# EasyEDA Pro project FrameworkGPU to MXM.epro, board PCB3
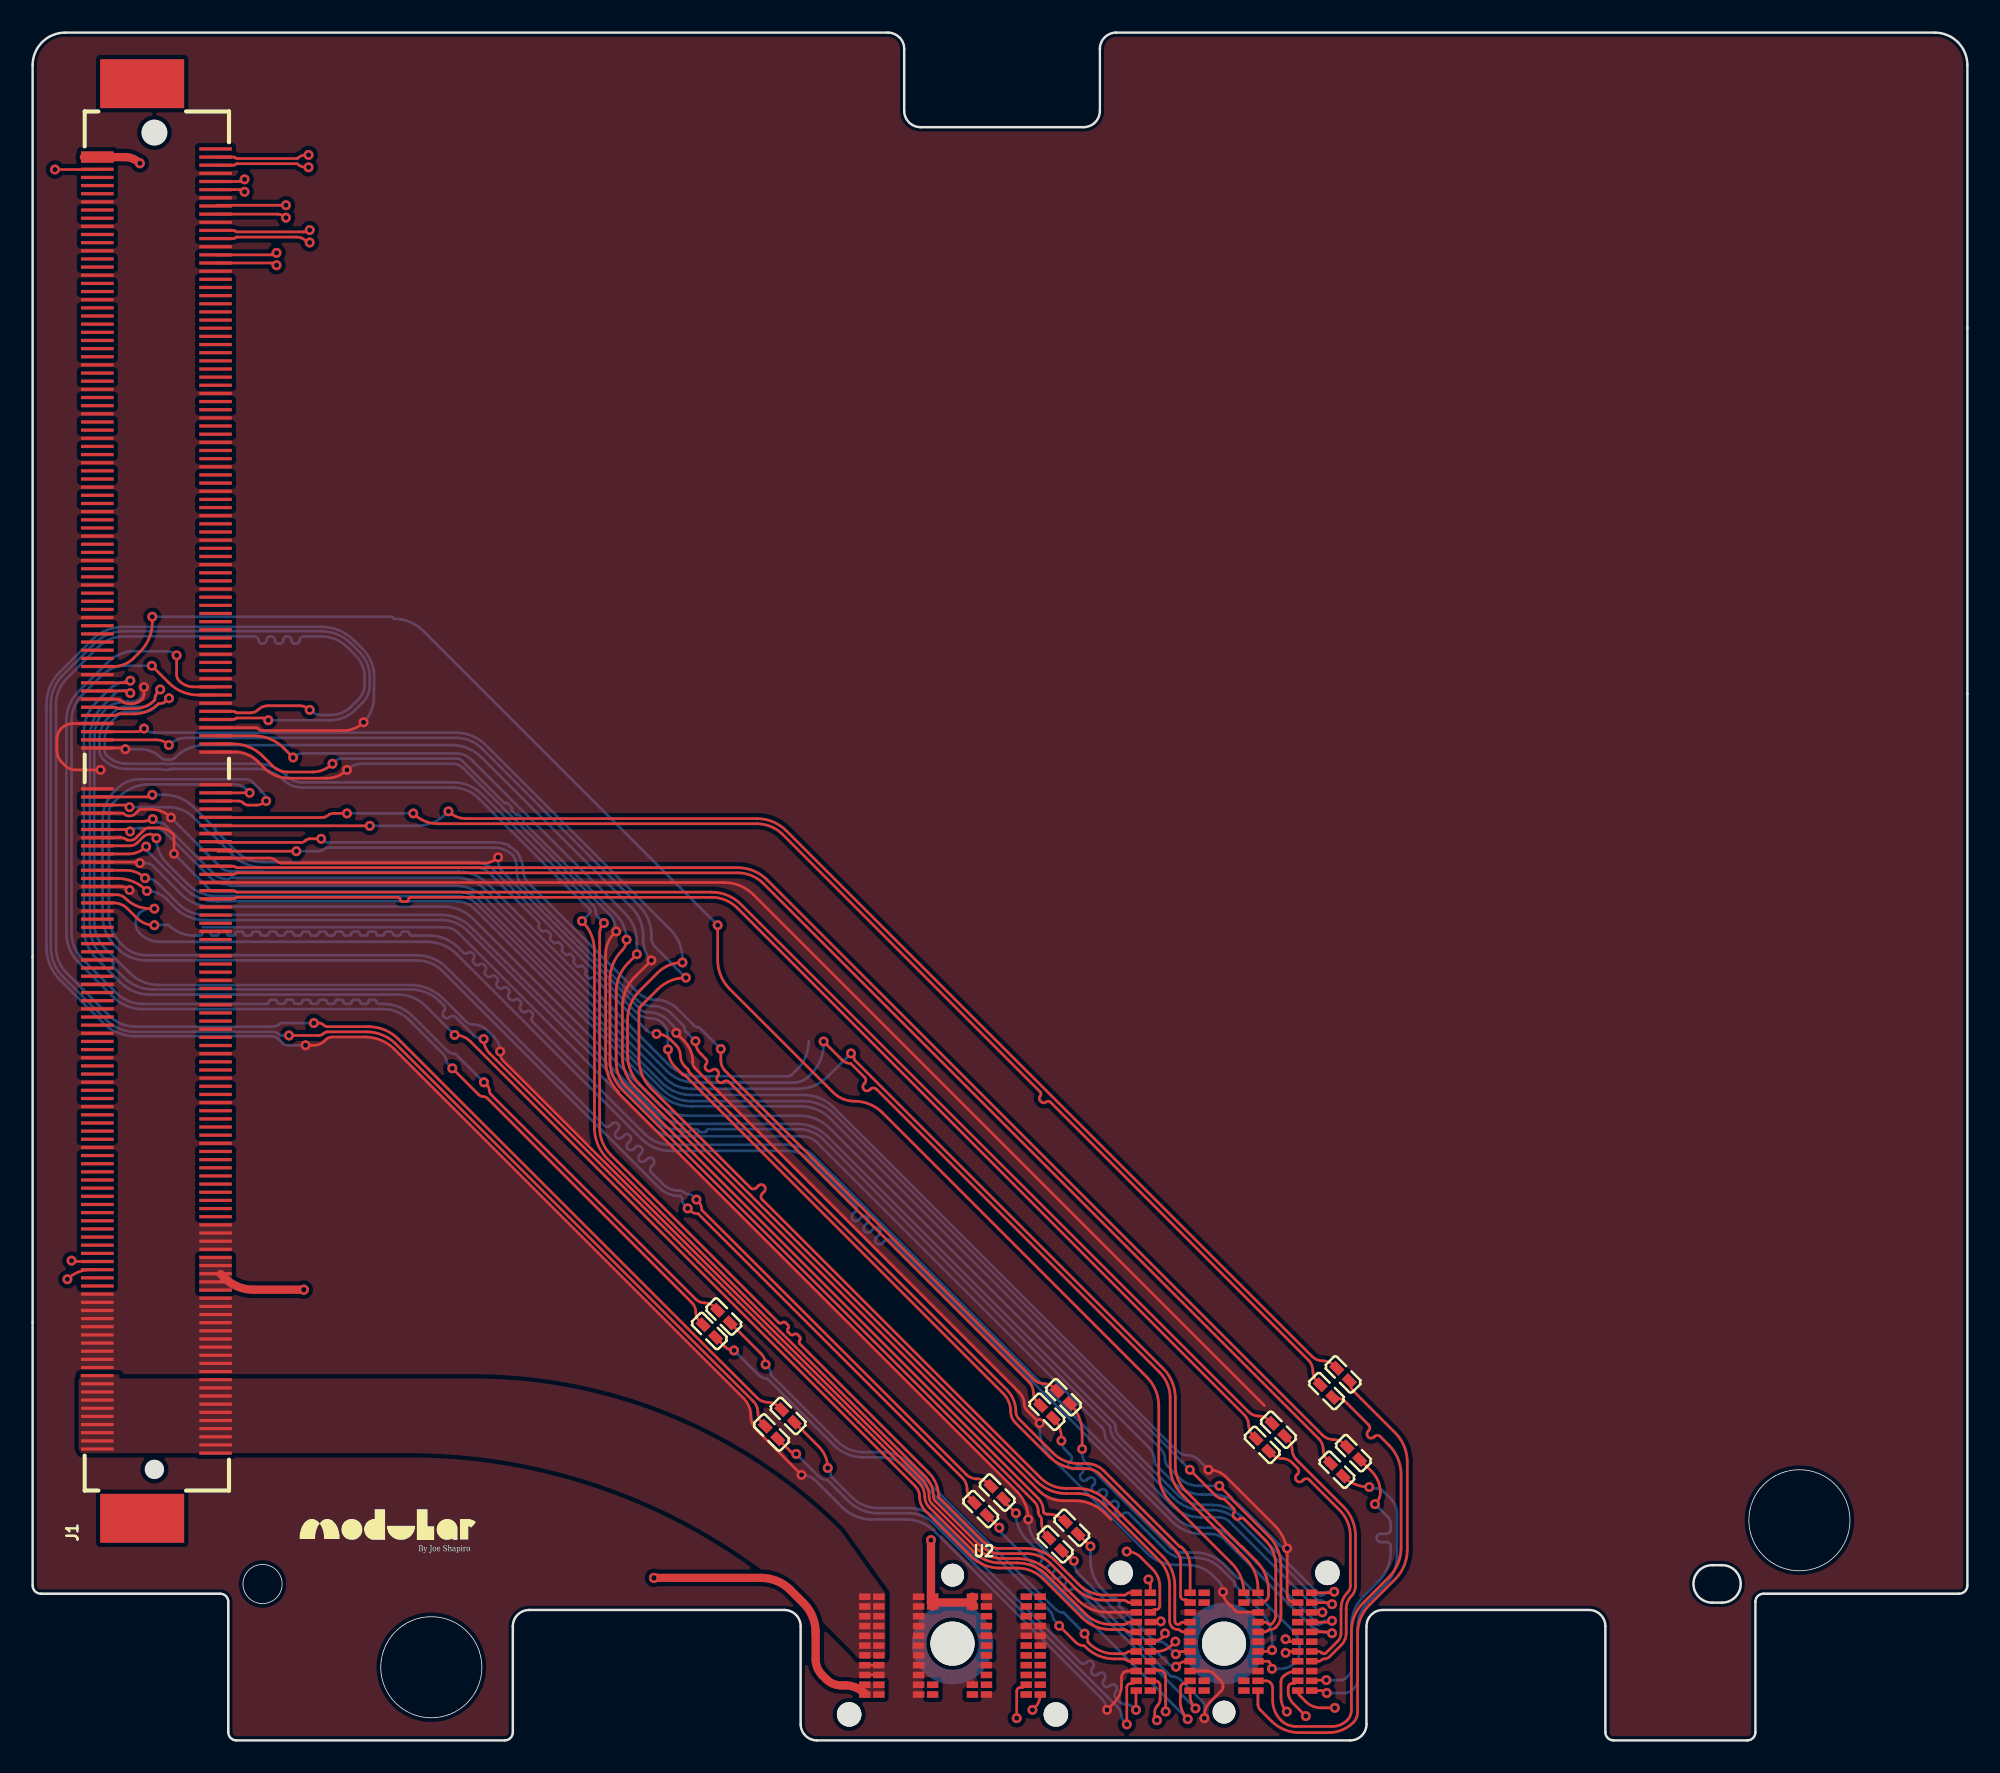
[diagram p1: board, top side]
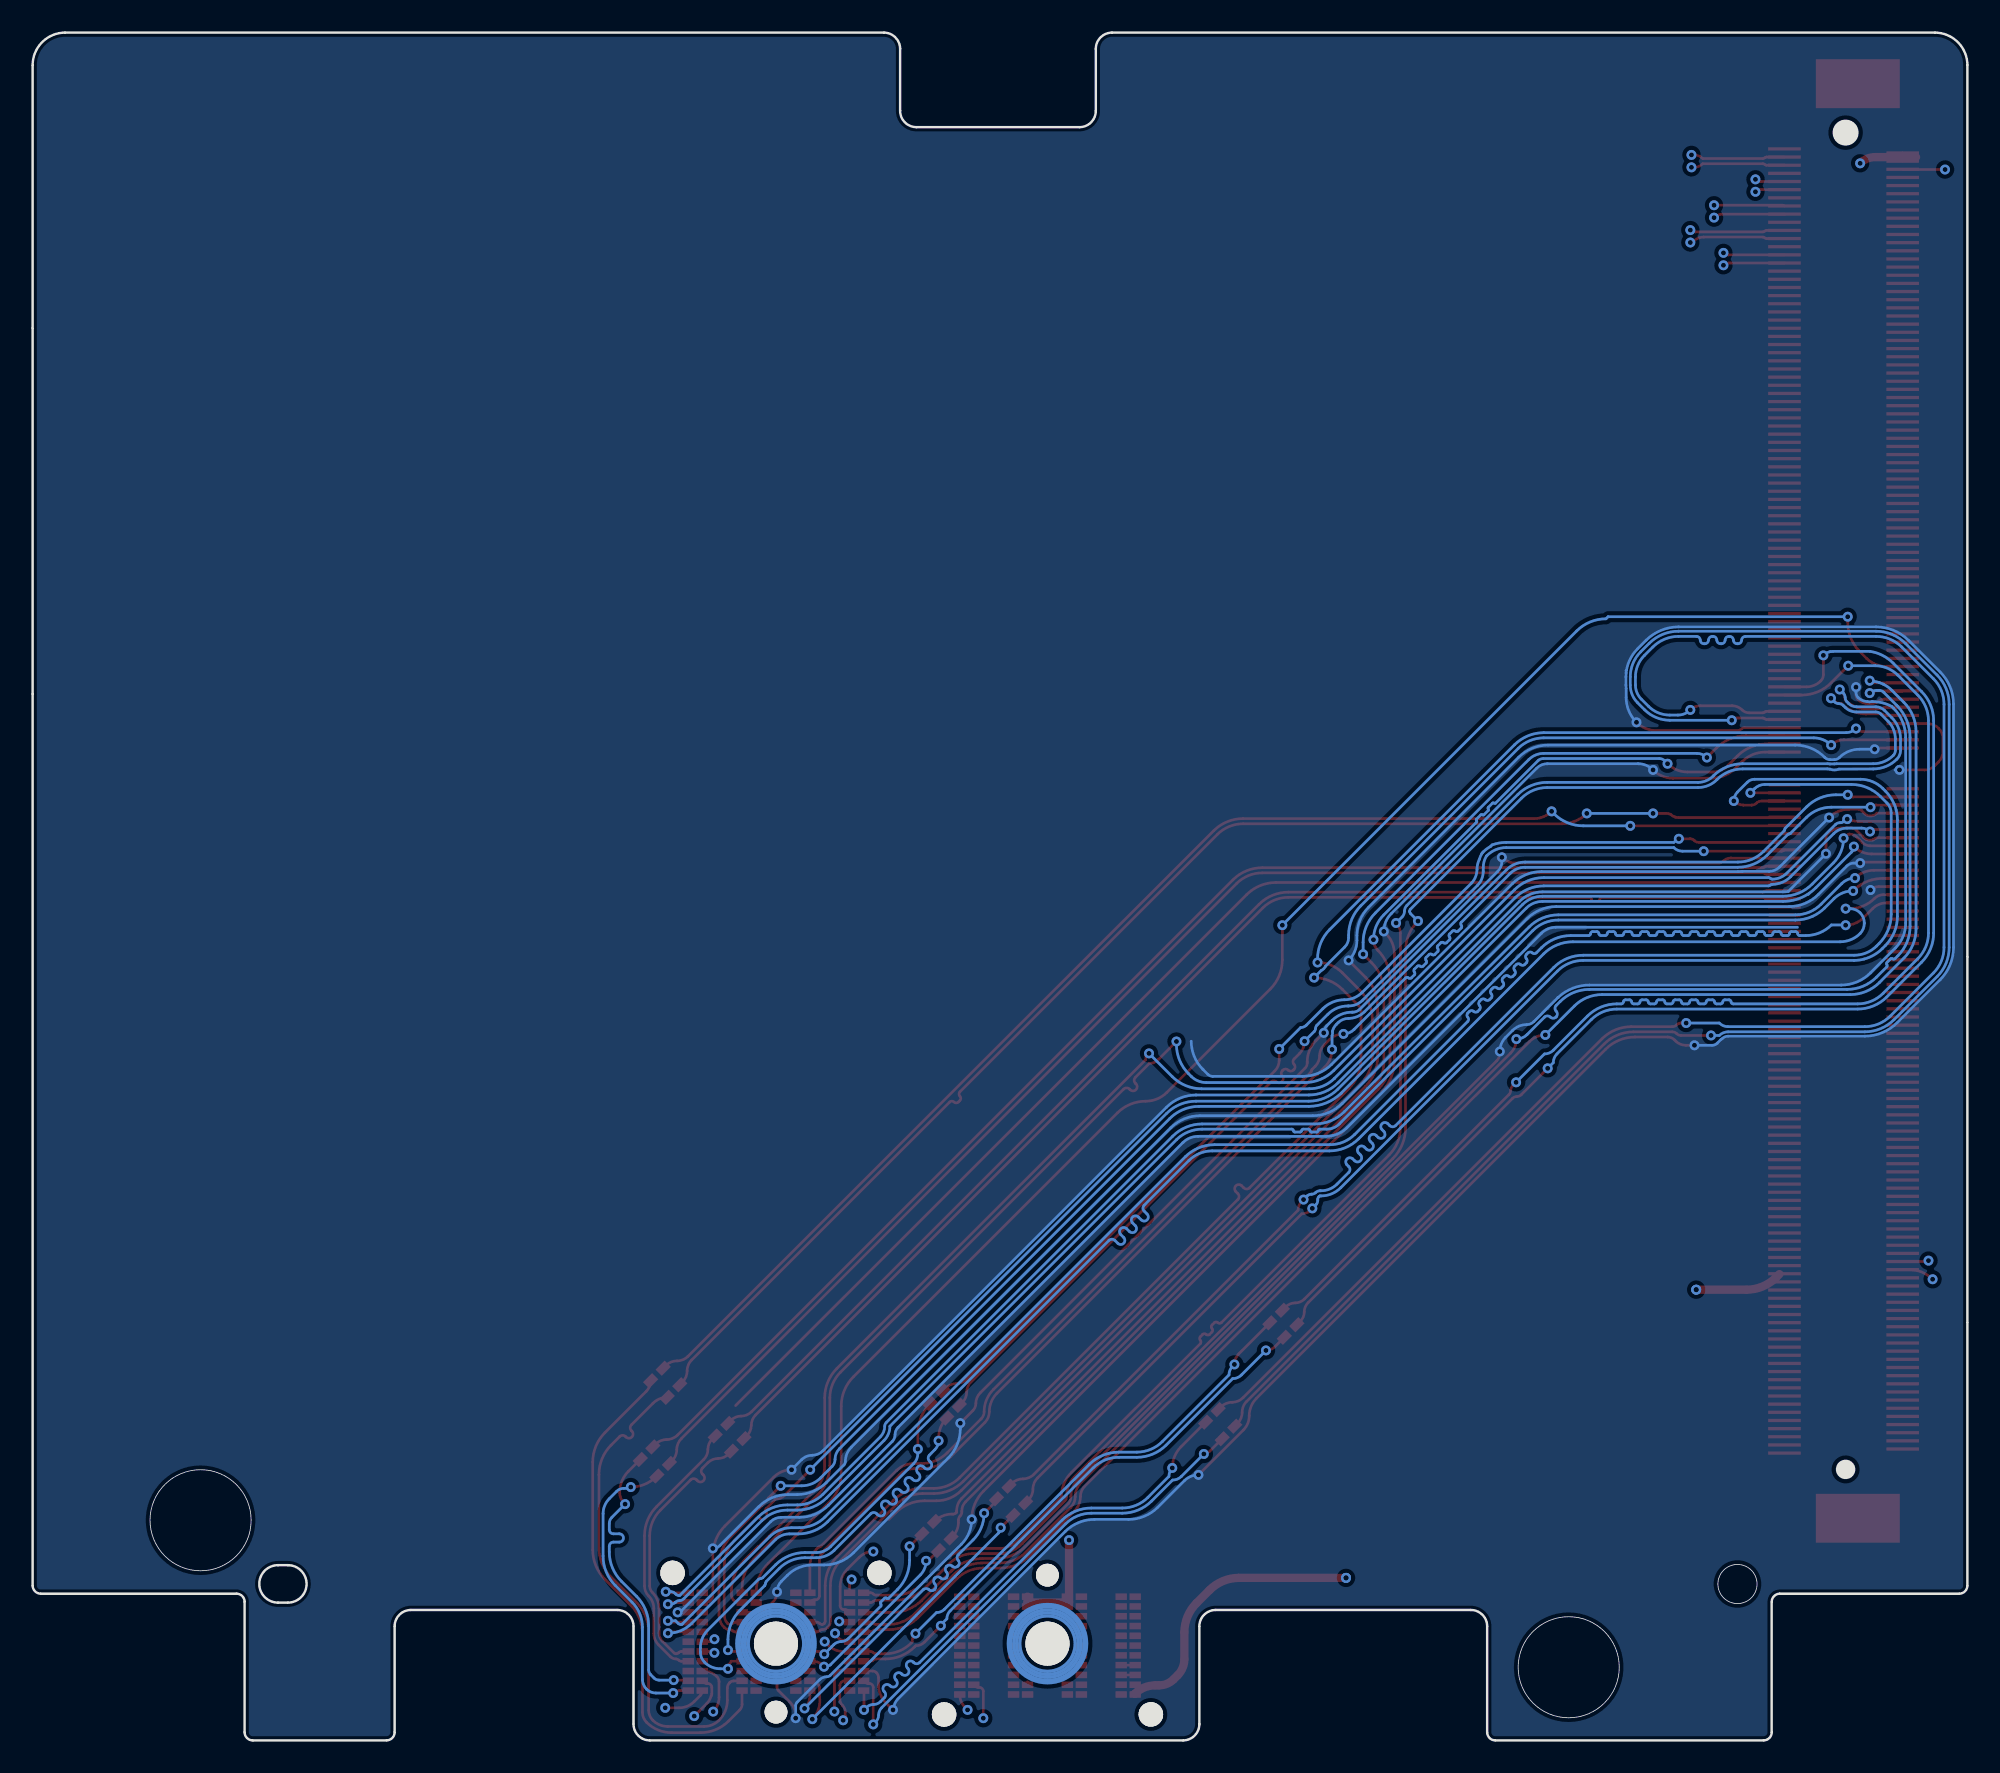
[diagram p2: board, bottom side, seen from below]

Outline 118.65 x 104.76 mm; copper layers: Top Layer, Inner1, Inner2, Inner3, Inner4, Inner5, Inner6, Bottom Layer. Coordinates in mm from the lower left corner of the outline.
Outline path: circle c14.1,9.59 r1.2 ; circle c24.45,4.49 r3.1 ; circle c108.35,13.5 r3.1 ; 0,102.76 arc(0.59,104.17) 2,104.76 52.45,104.76 arc(53.16,104.47) 53.45,103.76 53.45,99.96 arc(53.74,99.25) 54.45,98.96 64.45,98.96 arc(65.16,99.25) 65.45,99.96 65.45,103.76 arc(65.74,104.47) 66.45,104.76 116.65,104.76 arc(118.06,104.17) 118.65,102.76 118.65,9.5 arc(118.5,9.15) 118.15,9 106.15,9 arc(105.8,8.85) 105.65,8.5 105.65,0.5 arc(105.5,0.15) 105.15,0 96.95,0 arc(96.6,0.15) 96.45,0.5 96.45,7 arc(96.16,7.71) 95.45,8 82.8,8 arc(82.09,7.71) 81.8,7 81.8,1 arc(81.51,0.29) 80.8,0 48.1,0 arc(47.39,0.29) 47.1,1 47.1,7 arc(46.81,7.71) 46.1,8 30.45,8 arc(29.74,7.71) 29.45,7 29.45,0.5 arc(29.3,0.15) 28.95,0 12.5,0 arc(12.15,0.15) 12,0.5 12,8.5 arc(11.85,8.85) 11.5,9 0.5,9 arc(0.15,9.15) 0,9.5 0,102.76 ; 103,8.45 arc(101.85,9.6) 103,10.75 103.6,10.75 arc(104.75,9.6) 103.6,8.45 103,8.45
Stack: Top Layer 0.035mm Outer layer thickness 1oz / Dielectric1 0.1164mm 2116 RC54% 4.9mil / Inner1 0.0152mm Inner layer thickness / Dielectric2 0.3mm 0.3mm H/HOZ No copper / Inner2 0.0152mm Inner layer thickness / Dielectric3 0.0764mm 1080 RC67% 3.3mil / Dielectric4 0.0764mm 1080 RC67% 3.3mil / Inner3 0.0152mm Inner layer thickness / Dielectric5 0.3mm 0.3mm H/HOZ No copper / Inner4 0.0152mm Inner layer thickness / Dielectric6 0.0764mm 1080 RC67% 3.3mil / Dielectric7 0.0764mm 1080 RC67% 3.3mil / Inner5 0.0152mm Inner layer thickness / Dielectric8 0.3mm 0.3mm H/HOZ No copper / Inner6 0.0152mm Inner layer thickness / Dielectric9 0.1164mm 2116 RC54% 4.9mil / Bottom Layer 0.035mm Outer layer thickness 1oz

## Design rules (mm)
net PCIE_TX_0P: PCIE_TX_0
net $1N3808: DP9
net PCIE_TX_0N: PCIE_TX_0
net $1N3802: DP9
net PCIE_TX_1P: PCIE_TX_1
net $1N3862: DP8
net PCIE_TX_1N: PCIE_TX_1
net $1N3868: DP8
net PCIE_TX_2P: PCIE_TX_2
net $1N3922: DP7
net PCIE_TX_2N: PCIE_TX_2
net $1N3928: DP7
net PCIE_TX_3P: PCIE_TX_3
net $1N3982: DP6
net PCIE_TX_3N: PCIE_TX_3
net $1N3988: DP6
net PCIE_TX_4P: PCIE_TX_4
net $1N4042: DP5
net PCIE_TX_4N: PCIE_TX_4
net $1N4048: DP5
net PCIE_TX_5P: PCIE_TX_5
net $1N4102: DP2
net PCIE_TX_5N: PCIE_TX_5
net $1N4108: DP2
net PCIE_TX_6P: PCIE_TX_6
net $1N4162: DP3
net PCIE_TX_6N: PCIE_TX_6
net $1N4168: DP3
net PCIE_TX_7P: PCIE_TX_7
net $1N4222: DP4
net PCIE_TX_7N: PCIE_TX_7
net $1N4228: DP4
net DP_A_AUXP: DP_A_AUX
net DP_A_AUXN: DP_A_AUX
net DP_A_L3P: DP_A_L3
net DP_A_L3N: DP_A_L3
net DP_A_L2P: DP_A_L2
net DP_A_L2N: DP_A_L2
net DP_A_L1P: DP_A_L1
net DP_A_L1N: DP_A_L1
net DP_A_L0P: DP_A_L0
net DP_A_L0N: DP_A_L0
net PCIE_RX_0P: PCIE_RX_0
net PCIE_RX_0N: PCIE_RX_0
net PCIE_RX_1P: PCIE_RX_1
net PCIE_RX_1N: PCIE_RX_1
net PCIE_RX_2P: PCIE_RX_2
net PCIE_RX_2N: PCIE_RX_2
net PCIE_RX_3P: PCIE_RX_3
net PCIE_RX_3N: PCIE_RX_3
net PCIE_RX_4P: PCIE_RX_4
net PCIE_RX_4N: PCIE_RX_4
net PCIE_RX_5P: PCIE_RX_5
net PCIE_RX_5N: PCIE_RX_5
net PCIE_RX_6P: DP1
net PCIE_RX_6N: DP1
net PCIE_RX_7P: PCIE_RX_7
net PCIE_RX_7N: PCIE_RX_7
template: Custom Config
spacing copperThickness1oz (default): track to track 0.102, other pairs 0.152 to 0.3
spacing copperThickness2oz: track to track 0.203, other pairs 0.152 to 0.3
track width copperThickness1oz (default): min 0.127, default 0.254, max 2.54
track width copperThickness2oz: min 0.203, default 0.254, max 2.54
differential pair differentialPair (default): width min 0.127, default 0.254, max 2.54; gap min 0.152, default 0.152
via viaSize (default): diameter min 0.5, default 0.61, max 10; hole min 0.3, default 0.305, max 6.3
pour e983 uses copperRegion
pour e1099 uses copperRegion

## Placement (name value [footprint] x y rotation side)
C1  220nF  [C0402]  41.5 25.11 315 top
C2  220nF  [C0402]  42.39 26 315 top
C3  220nF  [C0402]  46.33 19.91 315 top
C4  220nF  [C0402]  45.31 18.89 315 top
C5  220nF  [C0402]  63.73 13.05 315 top
C6  220nF  [C0402]  62.71 12.03 315 top
C7  220nF  [C0402]  59.16 15.21 315 top
C8  220nF  [C0402]  58.14 14.19 315 top
C9  220nF  [C0402]  79.35 21.43 315 top
C10  220nF  [C0402]  80.36 22.45 315 top
C11  220nF  [C0402]  63.22 21.05 315 top
C12  220nF  [C0402]  62.2 20.16 315 top
C13  220nF  [C0402]  81 17.62 315 top
C14  220nF  [C0402]  79.98 16.6 315 top
C15  220nF  [C0402]  76.4 19.06 315 top
C16  220nF  [C0402]  75.41 18.13 315 top
J1  MXM3.0  [CONN-SMD_314P-P0.50_10151114-001TLF]  7.59 57.62 90 top
U2  FXBeam  [FW_FXBEAM_FULL]  64.74 5.94 0 top

## Footprints (pads in the part's own frame, mm; a bottom-side part is the same pattern mirrored in y, then rotated)
C0402
  rect 0.79x0.54 smd: 1(-0.545,0) 2(0.545,0)
CONN-SMD_314P-P0.50_10151114-001TLF
  rect 0.2x2 smd: 1(-30,-3.625) 2(-29.75,3.625) 3(-29.5,-3.625) 4(-29.25,3.625) 5(-29,-3.625) 6(-28.75,3.625) 7(-28.5,-3.625) 8(-28.25,3.625) 9(-28,-3.625) 10(-27.75,3.625) 11(-27.5,-3.625) 12(-27.25,3.625) 13(-27,-3.625) 14(-26.75,3.625) 15(-26.5,-3.625) 16(-26.25,3.625) 17(-26,-3.625) 18(-25.75,3.625) 19(-25.5,-3.625) 20(-25.25,3.625) 21(-25,-3.625) 22(-24.75,3.625) 23(-24.5,-3.625) 24(-24.25,3.625) 25(-24,-3.625) 26(-23.75,3.625) 27(-23.5,-3.625) 28(-23.25,3.625) 29(-23,-3.625) 30(-22.75,3.625) 31(-22.5,-3.625) 32(-22.25,3.625) 33(-22,-3.625) 34(-21.75,3.625) 35(-21.5,-3.625) 36(-21.25,3.625) 37(-21,-3.625) 38(-20.75,3.625) 39(-20.5,-3.625) 40(-20.25,3.625) 41(-20,-3.625) 42(-19.75,3.625) 43(-19.5,-3.625) 44(-19.25,3.625) 45(-19,-3.625) 46(-18.75,3.625) 47(-18.5,-3.625) 48(-18.25,3.625) 49(-18,-3.625) 50(-17.75,3.625) 51(-17.5,-3.625) 52(-17.25,3.625) 53(-17,-3.625) 54(-16.75,3.625) 55(-16.5,-3.625) 56(-16.25,3.625) 57(-16,-3.625) 58(-15.75,3.625) 59(-15.5,-3.625) 60(-15.25,3.625) 61(-15,-3.625) 62(-14.75,3.625) 63(-14.5,-3.625) 64(-14.25,3.625) 65(-14,-3.625) 66(-13.75,3.625) 67(-13.5,-3.625) 68(-13.25,3.625) 69(-13,-3.625) 70(-12.75,3.625) 71(-12.5,-3.625) 72(-12.25,3.625) 73(-12,-3.625) 74(-11.75,3.625) 75(-11.5,-3.625) 76(-11.25,3.625) 77(-11,-3.625) 78(-10.75,3.625) 79(-10.5,-3.625) 80(-10.25,3.625) 81(-10,-3.625) 82(-9.75,3.625) 83(-9.5,-3.625) 84(-9.25,3.625) 85(-9,-3.625) 86(-8.75,3.625) 87(-8.5,-3.625) 88(-8.25,3.625) 89(-8,-3.625) 90(-7.75,3.625) 91(-7.5,-3.625) 92(-7.25,3.625) 93(-7,-3.625) 94(-6.75,3.625) 95(-6.5,-3.625) 96(-6.25,3.625) 97(-6,-3.625) 98(-5.75,3.625) 99(-5.5,-3.625) 100(-5.25,3.625) 101(-5,-3.625) 102(-4.75,3.625) 103(-4.5,-3.625) 104(-4.25,3.625) 105(-4,-3.625) 106(-3.75,3.625) 107(-3.5,-3.625) 108(-3.25,3.625) 109(-3,-3.625) 110(-2.75,3.625) 111(-2.5,-3.625) 112(-2.25,3.625) 113(-2,-3.625) 114(-1.75,3.625) 115(-1.5,-3.625) 116(-1.25,3.625) 117(-1,-3.625) 118(-0.75,3.625) 119(-0.5,-3.625) 120(-0.25,3.625) 121(-0.001,-3.625) 122(0.25,3.625) 123(0.5,-3.625) 124(0.75,3.625) 125(1,-3.625) 133(3,-3.625) 134(3.249,3.625) 135(3.5,-3.625) 136(3.75,3.625) 137(4,-3.625) 138(4.25,3.625) 139(4.5,-3.625) 140(4.75,3.625) 141(5,-3.625) 142(5.25,3.625) 143(5.5,-3.625) 144(5.75,3.625) 145(6,-3.625) 146(6.25,3.625) 147(6.5,-3.625) 148(6.75,3.625) 149(7,-3.625) 150(7.25,3.625) 151(7.5,-3.625) 152(7.75,3.625) 153(8,-3.625) 154(8.25,3.625) 155(8.5,-3.625) 156(8.75,3.625) 157(9,-3.625) 158(9.25,3.625) 159(9.5,-3.625) 160(9.75,3.625) 161(10,-3.625) 162(10.25,3.625) 163(10.5,-3.625) 164(10.75,3.625) 165(11,-3.625) 166(11.25,3.625) 167(11.5,-3.625) 168(11.75,3.625) 169(12,-3.625) 170(12.25,3.625) 171(12.5,-3.625) 172(12.75,3.625) 173(13,-3.625) 174(13.25,3.625) 175(13.5,-3.625) 176(13.75,3.625) 177(14,-3.625) 178(14.25,3.625) 179(14.5,-3.625) 180(14.75,3.625) 181(15,-3.625) 182(15.25,3.625) 183(15.5,-3.625) 184(15.75,3.625) 185(16,-3.625) 186(16.25,3.625) 187(16.5,-3.625) 188(16.75,3.625) 189(17,-3.625) 190(17.25,3.625) 191(17.5,-3.625) 192(17.75,3.625) 193(18,-3.625) 194(18.25,3.625) 195(18.5,-3.625) 196(18.75,3.625) 197(19,-3.625) 198(19.25,3.625) 199(19.5,-3.625) 200(19.75,3.625) 201(20,-3.625) 202(20.25,3.625) 203(20.5,-3.625) 204(20.75,3.625) 205(21,-3.625) 206(21.25,3.625) 207(21.5,-3.625) 208(21.75,3.625) 209(22,-3.625) 210(22.25,3.625) 211(22.5,-3.625) 212(22.75,3.625) 213(23,-3.625) 214(23.25,3.625) 215(23.5,-3.625) 216(23.75,3.625) 217(24,-3.625) 218(24.25,3.625) 219(24.5,-3.625) 220(24.75,3.625) 221(25,-3.625) 222(25.25,3.625) 223(25.5,-3.625) 224(25.75,3.625) 225(26,-3.625) 226(26.25,3.625) 227(26.5,-3.625) 228(26.75,3.625) 229(27,-3.625) 230(27.25,3.625) 231(27.5,-3.625) 232(27.75,3.625) 233(28,-3.625) 234(28.25,3.625) 235(28.5,-3.625) 236(28.75,3.625) 237(29,-3.625) 238(29.25,3.625) 239(29.5,-3.625) 240(29.75,3.625) 241(30,-3.625) 242(30.25,3.625) 243(30.5,-3.625) 244(30.75,3.625) 245(31,-3.625) 246(31.25,3.625) 247(31.5,-3.625) 248(31.75,3.625) 249(32,-3.625) 250(32.25,3.625) 251(32.5,-3.625) 252(32.75,3.625) 253(33,-3.625) 254(33.25,3.625) 255(33.5,-3.625) 256(33.75,3.625) 257(34,-3.625) 258(34.25,3.625) 259(34.5,-3.625) 260(34.75,3.625) 261(35,-3.625) 262(35.25,3.625) 263(35.5,-3.625) 264(35.75,3.625) 265(36,-3.625) 266(36.25,3.625) 267(36.5,-3.625) 268(36.75,3.625) 269(37,-3.625) 270(37.25,3.625) 271(37.5,-3.625) 272(37.75,3.625) 273(38,-3.625) 274(38.25,3.625) 275(38.5,-3.625) 276(38.75,3.625) 277(39,-3.625) 278(39.25,3.625) 279(39.5,-3.625) 280(39.75,3.625) 281(40,-3.625) E1(-40,-3.625) E1(-39.5,-3.625) E1(-39,-3.625) E1(-38.5,-3.625) E1(-38,-3.625) E1(-37.5,-3.625) E1(-37,-3.625) E1(-36.5,-3.625) E1(-36,-3.625) E1(-35.5,-3.625) E2(-39.75,3.625) E2(-39.25,3.625) E2(-38.75,3.625) E2(-38.25,3.625) E2(-37.75,3.625) E2(-37.25,3.625) E2(-36.75,3.625) E2(-36.25,3.625) E2(-35.75,3.625) E2(-35.25,3.625) E3(-35,-3.625) E3(-34.5,-3.625) E3(-34,-3.625) E3(-33.5,-3.625) E3(-33,-3.625) E3(-32.5,-3.625) E3(-32,-3.625) E3(-31.5,-3.625) E3(-31,-3.625) E3(-30.5,-3.625) E4(-34.75,3.625) E4(-34.25,3.625) E4(-33.75,3.625) E4(-33.25,3.625) E4(-32.75,3.625) E4(-32.25,3.625) E4(-31.75,3.625) E4(-31.25,3.625) E4(-30.75,3.625) E4(-30.25,3.625)
  rect 3x5.15 smd: 282(44,0.875) 283(-44,0.875)
FW_FXBEAM_FULL
  round 1.5 hole 1.5: (-14.67,-4.34) (-1.99,-4.345) (1.98,4.34) (14.66,4.34)
  round 2.7 hole 2.7: (-8.33,0) (8.32,0)
  round 1.4 hole 1.4: (-8.325,4.2) (8.32,-4.2)
  rect 0.7x0.4 smd: PA1(-2.95,2.88) PA2(-3.81,2.88) PA3(-6.25,2.88) PA4(-7.11,2.88) PA5(-9.55,2.88) PA6(-10.41,2.88) PA7(-12.85,2.88) PA8(-13.71,2.88) PB1(-2.95,2.28) PB2(-3.81,2.28) PB3(-6.25,2.28) PB4(-7.11,2.28) PB5(-9.55,2.28) PB6(-10.41,2.28) PB7(-12.85,2.28) PB8(-13.71,2.28) PC1(-2.95,1.68) PC2(-3.81,1.68) PC3(-6.25,1.68) PC6(-10.41,1.68) PC7(-12.85,1.68) PC8(-13.71,1.68) PD1(-2.95,1.08) PD2(-3.81,1.08) PD3(-6.25,1.08) PD6(-10.41,1.08) PD7(-12.85,1.08) PD8(-13.71,1.08) PE1(-2.95,0.48) PE2(-3.81,0.48) PE3(-6.25,0.48) PE6(-10.41,0.48) PE7(-12.85,0.48) PE8(-13.71,0.48) PF1(-2.95,-0.12) PF2(-3.81,-0.12) PF3(-6.25,-0.12) PF6(-10.41,-0.12) PF7(-12.85,-0.12) PF8(-13.71,-0.12) PG1(-2.95,-0.72) PG2(-3.81,-0.72) PG3(-6.25,-0.72) PG6(-10.41,-0.72) PG7(-12.85,-0.72) PG8(-13.71,-0.72) PH1(-2.95,-1.32) PH2(-3.81,-1.32) PH3(-6.25,-1.32) PH6(-10.41,-1.32) PH7(-12.85,-1.32) PH8(-13.71,-1.32) PJ1(-2.95,-1.92) PJ2(-3.81,-1.92) PJ3(-6.25,-1.92) PJ6(-10.41,-1.92) PJ7(-12.85,-1.92) PJ8(-13.71,-1.92) PK1(-2.95,-2.52) PK2(-3.81,-2.52) PK3(-6.25,-2.52) PK4(-7.11,-2.52) PK5(-9.55,-2.52) PK6(-10.41,-2.52) PK7(-12.85,-2.52) PK8(-13.71,-2.52) PL1(-2.95,-3.12) PL2(-3.81,-3.12) PL3(-6.25,-3.12) PL4(-7.11,-3.12) PL5(-9.55,-3.12) PL6(-10.41,-3.12) PL7(-12.85,-3.12) PL8(-13.71,-3.12) SA1(13.7,3.12) SA2(12.84,3.12) SA3(10.4,3.12) SA4(9.54,3.12) SA5(7.1,3.12) SA6(6.24,3.12) SA7(3.8,3.12) SA8(2.94,3.12) SB1(13.7,2.52) SB2(12.84,2.52) SB3(10.4,2.52) SB4(9.54,2.52) SB5(7.1,2.52) SB6(6.24,2.52) SB7(3.8,2.52) SB8(2.94,2.52) SC1(13.7,1.92) SC2(12.84,1.92) SC3(10.4,1.92) SC6(6.24,1.92) SC7(3.8,1.92) SC8(2.94,1.92) SD1(13.7,1.32) SD2(12.84,1.32) SD3(10.4,1.32) SD6(6.24,1.32) SD7(3.8,1.32) SD8(2.94,1.32) SE1(13.7,0.72) SE2(12.84,0.72) SE3(10.4,0.72) SE6(6.24,0.72) SE7(3.8,0.72) SE8(2.94,0.72) SF1(13.7,0.12) SF2(12.84,0.12) SF3(10.4,0.12) SF6(6.24,0.12) SF7(3.8,0.12) SF8(2.94,0.12) SG1(13.7,-0.48) SG2(12.84,-0.48) SG3(10.4,-0.48) SG6(6.24,-0.48) SG7(3.8,-0.48) SG8(2.94,-0.48) SH1(13.7,-1.08) SH2(12.84,-1.08) SH3(10.4,-1.08) SH6(6.24,-1.08) SH7(3.8,-1.08) SH8(2.94,-1.08) SJ1(13.7,-1.68) SJ2(12.84,-1.68) SJ3(10.4,-1.68) SJ6(6.24,-1.68) SJ7(3.8,-1.68) SJ8(2.94,-1.68) SK1(13.7,-2.28) SK2(12.84,-2.28) SK3(10.4,-2.28) SK4(9.54,-2.28) SK5(7.1,-2.28) SK6(6.24,-2.28) SK7(3.8,-2.28) SK8(2.94,-2.28) SL1(13.7,-2.88) SL2(12.84,-2.88) SL3(10.4,-2.88) SL4(9.54,-2.88) SL5(7.1,-2.88) SL6(6.24,-2.88) SL7(3.8,-2.88) SL8(2.94,-2.88)

## Nets
As in the schematic, except:
PEX_REFCLK+: U2.SC2
PEX_REFCLK-: U2.SD2

Pads without a net: J1 2 4 10 12 14 16 18 19 20 21 22 23 24 25 26 27 28 29 30 31 32 33 34 35 38 39 40 41 42 43 44 45 48 49 50 51 54 55 56 57 60 61 62 63 66 67 68 69 72 73 74 75 78 79 80 81 84 85 86 87 90 91 92 93 153 155 156 158 159 160 161 162 163 164 165 167 168 169 170 171 172 175 176 177 178 181 182 183 184 187 188 189 190 193 194 195 196 199 200 201 202 205 206 207 208 211 212 213 214 217 218 219 220 223 224 225 226 227 229 230 231 232 233 234 235 236 237 238 239 240 241 242 243 245 246 247 248 249 252 254 258 260 264 266 270 272 274 281 282 283; U2 PA1 PA2 PB1 PB2 PC1 PC2 PC3 PD3 PF2 PF3 PG1 PG2 PG3 PH1 PH2 PJ2 PJ3 PK1 PK3 PK5 PL2 PL4 PL5 SA2 SA5 SB4 SB5 SK4 SK5 SL2 SL4 SL5 SL7

## Via types
v1: diameter 0.61, hole 0.305, Top Layer to Bottom Layer, 139 vias

## Routing (per net, layer and track width the routed paths; a pad name or vN(x,y) marks a point on that pad's centre or on a via; arc(x,y) is an arc through that point)
+3.3V: length 126.4
  Top Layer w0.165: J1.280 J1.278
  Top Layer w0.508: 3.15,97.12 5.66,97.12 arc(6.16,97.02) v1(6.58,96.74) ; 55.09,8.46 57.62,8.46 ; 55.09,8.46 v1(55.09,12.29) ; 55.09,8.46 arc(55.12,8.33) U2.PB5 ; U2.PA4 57.63,8.47 ; 57.63,8.47 U2.PB4 ; 57.63,8.47 arc(57.63,8.46) 57.62,8.46 ; 3.98,97.12 arc(3.97,97.12) 3.97,97.13
  Inner5 w0.165: v1(6.58,96.74) 9.9,93.42 arc(10.45,92.6) 10.64,91.62 10.64,39.12 arc(10.83,38.15) 11.39,37.32 35.68,13.03 arc(36.5,12.48) 37.47,12.29 v1(55.09,12.29)
+5V: length 51.4
  Top Layer w0.508: v1(16.63,27.65) 13.54,27.65 arc(12.57,27.84) 11.74,28.39 11.53,28.6 ; v1(38.11,9.97) 44.67,9.97 arc(45.64,9.78) 46.47,9.23 47.27,8.42 arc(47.83,7.6) 48.02,6.62 48.02,4.99 arc(48.12,4.45) 48.43,4 48.68,3.75 arc(49.09,3.47) 49.58,3.38 49.81,3.38 arc(50.48,3.24) 51.05,2.86 51.05,2.86
  Inner5 w0.508: v1(38.11,9.97) 36.63,9.97 arc(35.65,10.16) 34.83,10.71 18.64,26.9 arc(17.82,27.45) 16.84,27.65 v1(16.63,27.65)
GND: length 928
  Top Layer w0.165: v1(71.86,1.36) 71.86,1.49 arc(71.95,1.96) 72.21,2.36 72.91,3.05 arc(72.98,3.15) 73,3.27 73,3.34 arc(72.97,3.51) 72.87,3.65 72.38,4.15 arc(72.25,4.23) 72.11,4.26 U2.SJ6 ; J1.100 5.43,52.37 arc(5.71,52.32) v1(5.94,52.16) ; v1(65.89,1.87) 66.33,2.31 arc(66.66,2.81) 66.78,3.4 66.78,3.85 arc(66.81,4.02) 66.9,4.16 arc(67.01,4.23) 67.14,4.26 U2.SJ8 ; v1(37.95,47.85) 36.91,46.81 arc(36.36,45.99) 36.17,45.02 36.17,41.91 arc(36.36,40.94) 36.91,40.12 61.7,15.33 arc(62.4,14.86) 63.22,14.7 63.95,14.7 arc(64.92,14.51) 65.74,13.95 66.14,13.56 ; U2.SC3 74.03,7.86 arc(73.88,7.88) 73.76,7.97 73.27,8.46 arc(73.07,8.76) v1(73,9.11) ; v1(47.15,16.29) 44.4,19.04 arc(44.14,19.44) 44.04,19.91 arc(43.93,20.49) 43.59,20.99 22.18,42.4 arc(21.36,42.95) 20.38,43.15 18.39,43.15 arc(18.15,43.1) 17.95,42.97 17.88,42.89 arc(17.6,42.7) 17.27,42.64 v1(16.74,42.64) ; U2.SC8 65.91,7.86 arc(64.94,8.05) 64.11,8.6 62.31,10.4 arc(62.31,10.4) 62.31,10.4 62.31,10.4 arc(61.42,10.96) 60.39,11.16 59.54,11.16 arc(58.59,11.34) 57.78,11.88 55.13,14.53 arc(55.02,14.73) 54.98,14.95 arc(54.86,15.52) 54.54,16.01 28.86,41.68 arc(28.72,41.89) 28.68,42.14 v1(28.68,42.26) ; J1.118 5.55,56.87 arc(5.99,56.71) 6.39,56.94 6.51,57.06 arc(6.57,57.1) 6.64,57.12 7.26,57.12 arc(7.92,56.98) v1(8.48,56.61) ; U2.SC1 v1(79.09,7.86) ; U2.SB2 77.42,8.46 arc(77.23,8.49) 77.06,8.6 arc(76.97,8.74) 76.94,8.91 76.94,11.36 arc(76.93,11.57) 76.9,11.77 arc(76.66,12.52) 76.19,13.16 73.19,16.15 arc(72.7,16.49) v1(72.11,16.6) ; U2.PK4 57.63,3.59 ; v1(35.79,49.62) 35.66,49.5 arc(35.27,48.92) 35.14,48.24 35.14,41.72 arc(35.34,40.69) 35.9,39.8 35.9,39.77 arc(35.9,39.74) 35.92,39.71 60.34,15.29 arc(60.87,14.49) v1(61.06,13.56) ; v1(39.47,43.4) 39.95,42.92 arc(40.05,42.81) 40.15,42.68 arc(40.19,42.6) 40.25,42.53 arc(40.43,42.09) 40.49,41.62 40.49,41.55 arc(40.52,41.38) 40.61,41.24 60.54,21.32 arc(60.74,21.02) 60.81,20.67 arc(60.85,20.43) 60.99,20.23 v1(61.76,19.46) ; J1.106 6.43,53.87 arc(6.51,53.86) v1(6.58,53.81) ; J1.112 5.42,55.37 arc(5.53,55.36) 5.63,55.33 arc(5.7,55.29) 5.77,55.25 ; J1.101 42.4,52.62 arc(43.37,52.43) 44.2,51.88 75.54,20.54 ; J1.133 12.4,60.62 arc(13.17,60.47) 13.82,60.04 14.2,59.65 arc(14.9,59.18) 15.72,59.02 18.05,59.02 arc(18.71,59.15) v1(19.28,59.53) ; J1.139 13.68,62.12 arc(13.76,62.11) 13.82,62.07 arc(13.96,61.98) 14.12,61.94 19.07,61.94 arc(19.73,62.07) v1(20.29,62.45) ; v1(8.67,54.39) 8.67,55.44 arc(8.66,55.52) 8.61,55.59 arc(8.19,55.87) 7.69,55.97 7.14,55.97 arc(6.97,55.94) 6.83,55.85 6.56,55.58 arc(6.5,55.52) 6.43,55.47 arc(6.4,55.42) 6.36,55.37 arc(6.28,55.31) 6.19,55.26 arc(5.98,55.21) 5.77,55.25 ; v1(6.83,64.61) 6.83,64.15 arc(6.8,63.99) 6.7,63.85 arc(6.42,63.66) 6.09,63.59 5.92,63.59 arc(5.74,63.61) 5.57,63.67 arc(5.46,63.76) 5.33,63.83 arc(5.3,63.84) 5.26,63.85 arc(5.17,63.87) 5.07,63.87 J1.146 ; U2.PH8 U2.PH7 ; J1.140 2.49,62.37 arc(2.09,62.3) 1.75,62.07 arc(1.56,61.79) 1.5,61.46 1.5,60.67 arc(1.57,60.32) 1.77,60.02 2.01,59.78 arc(2.29,59.6) 2.62,59.53 v1(4.16,59.53) ; J1.134 5.51,60.87 arc(5.61,60.85) v1(5.69,60.8) ; J1.107 14.52,54.12 arc(14.76,54.08) 14.96,53.94 arc(15.1,53.85) 15.27,53.81 27.69,53.81 arc(28.08,53.88) 28.43,54.07 arc(28.49,54.12) v1(28.55,54.17) ; U2.PJ8 U2.PJ7 ; 5.77,55.25 arc(5.79,55.23) 5.82,55.21
  Bottom Layer w0.165: v1(4.16,59.53) 4.44,59.53 ; 65.86,1.86 65.83,1.89 ; v1(6.83,64.61) 6.83,64.28 arc(6.8,64.12) 6.7,63.97 arc(6.44,63.79) 6.13,63.72 arc(5.99,63.7) 5.86,63.72 5.82,63.72 arc(5.21,63.64) 4.64,63.42 4.53,63.31 arc(3.98,62.49) 3.78,61.51 3.78,50.14 arc(3.95,49.31) 4.42,48.61 5.95,47.08 arc(6.77,46.53) 7.74,46.33 23.18,46.33 arc(24.21,46.14) 25.1,45.58 25.1,45.58 arc(25.1,45.58) 25.1,45.58 26.59,44.09 arc(26.79,43.96) 27.02,43.91 arc(27.49,43.82) 27.89,43.55 28.32,43.12 arc(28.58,42.73) v1(28.68,42.26) ; v1(6.58,53.81) 6.96,53.81 arc(7.19,53.77) 7.39,53.64 9.14,51.89 arc(9.96,51.34) 10.93,51.15 25.21,51.15 arc(26.18,50.95) 27.01,50.4 38.35,39.06 arc(39.17,38.51) 40.14,38.32 47.05,38.32 arc(48.03,38.13) 48.85,37.58 68.45,17.98 arc(68.71,17.58) 68.81,17.11 arc(68.83,16.99) 68.9,16.89 69.97,15.82 arc(70.79,15.27) 71.76,15.08 72.33,15.08 arc(73.3,14.89) 74.12,14.34 76.5,11.96 arc(76.7,11.82) v1(76.94,11.78) ; v1(8.67,54.39) 10.98,52.07 arc(11.15,52.06) 11.31,52.05 26.05,52.05 arc(26.82,51.9) 27.47,51.46 38.6,40.33 arc(39.42,39.78) 40.39,39.59 47.31,39.59 arc(48.28,39.4) 49.1,38.85 70.19,17.76 arc(70.49,17.56) 70.84,17.49 arc(71.19,17.42) 71.49,17.22 v1(72.11,16.6) ; v1(5.69,60.8) 6.62,60.8 arc(7.28,60.67) 7.85,60.29 arc(7.99,60.2) 8.15,60.16 8.43,60.16 arc(8.6,60.2) 8.74,60.29 8.75,60.31 arc(9.58,60.86) 10.55,61.05 25.72,61.05 arc(26.69,60.86) 27.51,60.31 36.72,51.1 arc(37.25,50.31) 37.44,49.37 37.44,49.07 arc(37.57,48.41) v1(37.95,47.85) ; v1(71.86,1.36) 71.86,2.13 arc(71.83,2.24) 71.77,2.34 70.38,3.72 arc(70.19,3.86) 69.95,3.9 arc(69.83,3.93) 69.73,3.99 61.69,12.04 arc(61.22,12.73) v1(61.06,13.56) ; 10.42,49.88 25.25,49.88 arc(25.72,49.78) 26.11,49.52 38.04,37.59 arc(38.64,37.19) 39.34,37.05 47.19,37.05 arc(47.68,36.95) 48.11,36.67 65.58,19.2 arc(65.71,19) 65.76,18.76 arc(65.81,18.53) 65.94,18.33 69.84,14.43 arc(70.67,13.88) 71.64,13.68 72.74,13.68 arc(73.1,13.61) 73.39,13.41 78.85,7.96 arc(78.96,7.88) v1(79.09,7.86) ; v1(16.74,42.64) 15.65,42.64 arc(15.48,42.67) 15.34,42.77 15.11,43 arc(15.06,43.02) 15.02,43.05 arc(14.87,43.16) 14.68,43.2 6.3,43.2 arc(5.22,43.41) 4.31,44.02 1.67,46.66 arc(1.06,47.57) 0.85,48.64 0.85,63.56 arc(1.06,64.63) 1.67,65.54 3.61,67.48 arc(4.52,68.09) 5.6,68.31 17.72,68.31 arc(18.79,68.09) 19.7,67.48 20.23,66.96 arc(20.67,66.36) 20.91,65.65 20.93,65.63 20.93,65.49 arc(20.94,65.36) 20.94,65.24 20.94,64.74 arc(20.94,64.63) 20.93,64.52 20.93,63.98 arc(20.76,63.15) v1(20.29,62.45) ; v1(28.55,54.17) 28.55,53.92 arc(28.61,53.59) 28.8,53.31 37.26,44.85 arc(37.46,44.72) 37.69,44.67 37.73,44.67 arc(38.4,44.54) 38.96,44.16 39.29,43.83 arc(39.42,43.64) v1(39.47,43.4) ; v1(8.48,56.61) 11.52,53.58 arc(11.81,53.38) 12.17,53.31 13.8,53.31 arc(13.94,53.3) 14.07,53.29 26.11,53.29 arc(27.08,53.1) 27.91,52.55 38.98,41.48 arc(39.8,40.93) 40.78,40.73 46.28,40.73 arc(46.44,40.77) 46.58,40.86 46.88,41.16 arc(47.41,41.95) 47.6,42.89 ; v1(61.76,19.46) 61.76,19.12 arc(61.95,18.14) 62.5,17.32 68.32,11.51 arc(69.14,10.95) 70.11,10.76 70.84,10.76 arc(71.66,10.6) 72.36,10.13 72.73,9.76 arc(72.93,9.46) v1(73,9.11) ; v1(19.28,59.53) arc(19.7,59.81) 20.2,59.91 25.75,59.91 arc(26.11,59.84) 26.41,59.64 35.34,50.71 arc(35.67,50.21) v1(35.79,49.62) ; 65.85,1.91 arc(65.78,2.25) 65.58,2.54 55.33,12.81 arc(54.5,13.36) 53.53,13.56 51.44,13.56 arc(50.47,13.75) 49.65,14.3 48.02,15.93 arc(47.62,16.19) v1(47.15,16.29)
(no net): length 2.7
  Top Layer w0.165: v1(79.86,2) 79,2 arc(78.5,2.1) 78.08,2.38 77.71,2.75 arc(77.62,2.89) U2.SL2
DP_A_AUXN: length 144.3
  Top Layer w0.165: 68.61,4.31 69.06,4.31 arc(69.22,4.28) 69.35,4.19 arc(69.45,4.05) 69.48,3.88 v1(69.48,1.77) ; J1.277 12.32,96.62 arc(12.38,96.64) 12.43,96.67 arc(12.48,96.7) 12.54,96.72 16.23,96.72 arc(16.48,96.55) 16.77,96.49 v1(16.92,96.49)
  Inner5 w0.165: v1(69.48,1.77) 69.59,1.66 arc(69.76,1.42) 69.82,1.13 arc(70.26,0.83) 70.78,0.73 78.83,0.73 arc(79.66,0.89) 80.36,1.36 arc(80.65,1.79) 80.75,2.28 80.75,29.56 arc(80.67,29.74) 80.49,29.81 80.15,29.81 arc(79.9,30.06) 80.15,30.32 80.49,30.32 arc(80.67,30.39) 80.75,30.57 80.75,30.99 arc(80.58,31.84) 80.09,32.56 20.29,92.36 arc(19.74,93.19) 19.54,94.16 19.54,95.06 arc(19.42,95.69) 19.06,96.22 arc(18.76,96.42) 18.41,96.49 v1(16.92,96.49)
DP_A_AUXP: length 144.3
  Top Layer w0.165: v1(16.92,97.26) 16.77,97.26 arc(16.48,97.2) 16.23,97.03 12.54,97.03 arc(12.48,97.04) 12.43,97.08 arc(12.38,97.11) 12.32,97.12 J1.279 ; U2.SK7 68.84,3.66 arc(68.96,3.63) 69.06,3.56 arc(69.12,3.47) 69.14,3.35 69.14,2.54 arc(69.1,2.32) 68.98,2.14 68.97,2.13 arc(68.86,1.95) 68.81,1.74 68.81,1.52 arc(68.84,1.38) 68.92,1.27
  Inner5 w0.165: v1(68.94,1.23) 69.05,1.12 arc(69.3,0.96) 69.59,0.9 arc(70.13,0.54) 70.78,0.41 78.83,0.41 arc(79.78,0.6) 80.59,1.14 arc(80.94,1.66) 81.06,2.28 81.06,30.99 arc(80.87,31.96) 80.32,32.78 20.51,92.59 arc(20.03,93.31) 19.86,94.16 19.86,95.35 arc(19.74,95.93) 19.41,96.43 19.14,96.71 arc(18.67,97.05) 18.11,97.23 arc(17.96,97.25) 17.81,97.26 v1(16.92,97.26)
DP_A_HPD: length 117.3
  Top Layer w0.165: v1(1.37,96.36) 3.93,96.36 arc(3.95,96.36) J1.276 ; U2.SA7 68.54,9.59 arc(68.51,9.74) v1(68.43,9.87)
  Inner2 w0.165: v1(1.37,96.36) 1.37,88.65 arc(1.56,87.68) 2.11,86.85 42.92,46.05 arc(43.47,45.23) 43.66,44.25 43.66,41.15 arc(43.85,40.18) 44.41,39.35 67.68,16.08 arc(68.23,15.25) 68.43,14.28 v1(68.43,9.87)
DP_A_L0N: length 115.4
  Top Layer w0.165: v1(69.44,6.57) 69.44,6.44 69.42,6.42 arc(69.02,6.15) U2.SF7 ; J1.253 14.62,90.62 arc(14.81,90.59) v1(14.96,90.49)
  Inner2 w0.165: v1(69.44,6.57) 69.65,6.78 arc(69.79,6.87) 69.95,6.9 arc(70.11,6.93) 70.24,7.03 71.01,7.8 arc(71.5,8.52) 71.67,9.37 71.67,13.27 arc(71.5,14.12) 71.01,14.84 46.1,39.75 arc(45.56,40.55) 45.38,41.5 45.38,44 arc(45.21,44.85) 44.73,45.57 23.01,67.29 arc(22.46,68.11) 22.26,69.09 22.26,78.49 arc(22.19,78.67) 22.01,78.74 21.66,78.74 arc(21.41,79) 21.66,79.25 22.01,79.25 arc(22.19,79.33) 22.26,79.51 22.26,84.51 arc(22.09,85.36) 21.61,86.08 17.64,90.06 arc(16.92,90.54) 16.07,90.71 15.81,90.71 arc(15.66,90.68) 15.54,90.6 arc(15.42,90.51) 15.27,90.49 v1(14.96,90.49)
DP_A_L0P: length 115.4
  Top Layer w0.165: U2.SG7 68.93,5.46 arc(69.43,5.55) 69.85,5.83 v1(70.08,6.06) ; J1.255 14.66,91.12 arc(14.82,91.16) v1(14.96,91.25)
  Inner2 w0.165: v1(14.96,91.25) 15.27,91.25 arc(15.42,91.22) 15.54,91.14 arc(15.66,91.05) 15.81,91.03 16.07,91.03 arc(17.04,90.83) 17.86,90.28 21.84,86.31 arc(22.39,85.48) 22.58,84.51 22.58,69.09 arc(22.75,68.24) 23.23,67.51 44.95,45.8 arc(45.5,44.97) 45.69,44 45.69,41.5 arc(45.86,40.67) 46.32,39.98 71.24,15.06 arc(71.79,14.24) 71.98,13.27 71.98,9.37 arc(71.79,8.39) 71.24,7.57 70.53,6.86 arc(70.44,6.73) 70.41,6.57 arc(70.38,6.41) 70.29,6.27 v1(70.08,6.06)
DP_A_L1N: length 115.1
  Top Layer w0.165: U2.SC7 68.64,7.96 arc(68.72,8) 68.8,8.02 68.89,8.02 arc(69.06,8.09) 69.13,8.26 69.13,9.43 arc(69.01,10.01) 68.68,10.51 67.96,11.23 arc(67.56,11.49) v1(67.09,11.59) ; J1.259 12.32,92.12 arc(12.38,92.14) 12.43,92.17 arc(12.48,92.2) 12.54,92.22 16.19,92.22 arc(16.32,92.21) 16.44,92.17 arc(16.62,92.09) 16.77,91.98 arc(16.87,91.91) v1(16.99,91.88)
  Inner5 w0.165: v1(16.99,91.88) 17.24,91.88 arc(17.45,91.92) 17.62,92.04 17.65,92.07 arc(17.69,92.1) 17.73,92.11 17.85,92.11 arc(17.87,92.1) 17.9,92.08 68.7,41.28 arc(69.18,40.56) 69.35,39.71 69.35,14.54 arc(69.34,14.52) 69.33,14.5 arc(69.32,14.48) 69.32,14.46 69.32,13.33 arc(69.22,12.83) 68.93,12.41 68.83,12.31 arc(68.13,11.82) 67.31,11.6 arc(67.2,11.59) v1(67.09,11.59)
DP_A_L1P: length 115.1
  Top Layer w0.165: J1.261 12.32,92.62 arc(12.38,92.61) 12.43,92.58 arc(12.48,92.55) 12.54,92.53 16.67,92.53 arc(16.74,92.55) 16.8,92.59 arc(16.87,92.63) 16.94,92.65 v1(16.99,92.65) ; v1(69.18,7.3) 69.09,7.21 68.77,7.21 arc(68.66,7.24) U2.SD7
  Inner5 w0.165: v1(69.18,7.3) 69.7,7.81 69.7,14.46 arc(69.69,14.48) 69.68,14.5 arc(69.67,14.52) 69.67,14.54 69.67,39.71 arc(69.47,40.68) 68.92,41.51 66.22,44.21 arc(66.17,44.34) 66.22,44.48 arc(66.28,44.62) 66.22,44.76 66.14,44.84 arc(66,44.9) 65.86,44.84 arc(65.73,44.78) 65.59,44.84 65.5,44.93 arc(65.45,45.06) 65.5,45.2 arc(65.56,45.34) 65.5,45.47 65.42,45.56 arc(65.28,45.62) 65.14,45.56 arc(65.01,45.5) 64.87,45.56 18.12,92.31 arc(18,92.39) 17.85,92.42 17.84,92.42 arc(17.7,92.45) 17.57,92.53 arc(17.45,92.62) 17.3,92.65 v1(16.99,92.65)
DP_A_L2N: length 129.5
  Top Layer w0.165: J1.265 15.01,93.62 arc(15.3,93.57) v1(15.54,93.41) ; U2.SJ2 77.53,4.26 arc(77.07,4.16) 76.68,3.9 arc(76.59,3.76) 76.55,3.6 76.55,2.63 arc(76.65,2.16) v1(76.91,1.77)
  Inner2 w0.165: v1(15.54,93.41) 15.69,93.41 arc(15.98,93.46) 16.23,93.63 arc(16.93,93.49) 17.53,93.09 24.29,86.33 24.29,70.23 arc(24.49,69.26) 25.04,68.43 44.53,48.95 arc(44.6,48.77) 44.53,48.59 44.39,48.45 arc(44.39,48.09) 44.75,48.09 44.88,48.23 arc(45.06,48.3) 45.24,48.23 80.03,13.44 arc(80.51,12.72) 80.68,11.87 80.68,7.5 arc(80.54,6.76) 80.12,6.14 77.58,3.6 arc(77.4,3.33) 77.34,3.01 77.34,2.79 arc(77.23,2.24) v1(76.91,1.77)
DP_A_L2P: length 129.4
  Top Layer w0.165: U2.SK2 77.48,3.56 arc(77.41,3.51) 77.33,3.49 77.23,3.49 arc(77.07,3.42) 77,3.26 77,2.86 arc(77.01,2.79) 77.04,2.72 arc(77.15,2.47) 77.31,2.26 v1(78.08,1.49) ; v1(15.54,94.17) 11.33,94.17 arc(11.27,94.16) J1.267
  Inner2 w0.165: v1(15.54,94.17) 15.69,94.17 arc(15.98,94.11) 16.23,93.95 arc(17.06,93.78) 17.75,93.31 19.09,91.98 arc(19.25,91.91) 19.41,91.98 arc(19.56,92.04) 19.72,91.98 19.77,91.93 arc(19.83,91.78) 19.77,91.62 arc(19.7,91.46) 19.77,91.3 24.52,86.55 arc(24.59,86.45) 24.61,86.33 24.61,70.23 arc(24.78,69.38) 25.26,68.66 80.26,13.66 arc(80.81,12.84) 81,11.87 81,7.5 arc(80.83,6.64) 80.35,5.92 77.8,3.38 arc(77.69,3.21) 77.65,3.01 77.65,2.51 arc(77.76,1.96) v1(78.08,1.49)
DP_A_L3N: length 122.7
  Top Layer w0.165: U2.SF2 76.74,6.06 arc(76.74,6.16) v1(76.84,6.21) ; J1.271 12.68,95.12 arc(12.85,95.09) v1(13,94.99)
  Inner5 w0.165: v1(13,94.99) 13.15,94.99 arc(13.44,95.05) 13.69,95.22 15.72,95.22 arc(16.16,95.13) 16.54,94.88 77.41,34 arc(77.89,33.28) 78.06,32.43 78.06,13.91 arc(77.99,13.73) 77.81,13.66 77.74,13.66 arc(77.48,13.4) 77.74,13.15 77.81,13.15 arc(77.99,13.07) 78.06,12.9 78.06,6.58 arc(78.01,6.3) 77.85,6.07 77.74,5.96 arc(77.73,5.95) 77.72,5.95 77.61,5.95 arc(77.57,5.96) 77.53,5.98 77.5,6.01 arc(77.28,6.16) 77.03,6.21 v1(76.84,6.21)
DP_A_L3P: length 122.7
  Top Layer w0.165: U2.SG2 77.22,5.46 arc(77.02,5.47) v1(76.84,5.37) ; J1.273 12.68,95.62 arc(12.85,95.66) v1(13,95.76)
  Inner5 w0.165: v1(13,95.76) 13.15,95.76 arc(13.44,95.7) 13.69,95.53 15.72,95.53 arc(16.28,95.42) 16.76,95.1 77.64,34.23 arc(78.19,33.4) 78.38,32.43 78.38,6.58 arc(78.3,6.18) 78.08,5.84 77.97,5.74 arc(77.85,5.66) 77.72,5.63 77.64,5.63 arc(77.57,5.62) 77.52,5.58 77.46,5.53 arc(77.29,5.41) 77.09,5.37 v1(76.84,5.37)
PCIE_RX_0N: length 101.2
  Top Layer w0.165: U2.SD8 67.27,7.26 arc(67.18,7.24) 67.1,7.19 arc(67.02,7.13) 66.93,7.11 66.14,7.11 arc(65.29,7.28) 64.57,7.77 62.19,10.14 arc(61.36,10.7) 60.39,10.89 59.31,10.89 arc(58.46,11.06) 57.74,11.54 54.98,14.3 arc(54.78,14.6) 54.71,14.95 arc(54.62,15.42) 54.35,15.82 28.02,42.15 arc(27.75,42.55) v1(27.66,43.02) ; J1.148 5.67,64.37 arc(5.85,64.34) v1(5.99,64.24)
  Bottom Layer w0.165: v1(5.99,64.24) 5.99,64.24 ; 5.97,64.24 arc(5.77,64.37) 5.55,64.41 5.42,64.41 arc(5.27,64.38) 5.13,64.29 4.34,63.5 arc(4.31,63.47) 4.27,63.43 arc(3.71,62.54) 3.52,61.51 3.52,49.93 arc(3.71,48.95) 4.26,48.13 4.45,47.94 arc(4.51,47.91) 4.58,47.94 arc(4.64,47.97) 4.71,47.94 4.94,47.71 arc(4.96,47.65) 4.94,47.58 arc(4.91,47.52) 4.94,47.45 5.58,46.81 arc(6.4,46.26) 7.38,46.07 23.18,46.07 arc(24.15,45.87) 24.97,45.32 25.22,45.08 arc(25.29,44.91) 25.22,44.73 arc(25.15,44.56) 25.22,44.38 25.23,44.37 arc(25.4,44.3) 25.58,44.37 arc(25.75,44.44) 25.93,44.37 27.01,43.29 arc(27.31,43.09) v1(27.66,43.02)
PCIE_RX_0P: length 101.4
  Top Layer w0.165: U2.SE8 67.27,6.66 arc(67.18,6.67) 67.1,6.73 arc(67.02,6.78) 66.93,6.8 66.14,6.8 arc(65.16,6.99) 64.34,7.54 61.96,9.92 arc(61.24,10.4) 60.39,10.57 59.31,10.57 arc(58.34,10.76) 57.52,11.31 54.76,14.08 arc(54.49,14.48) 54.39,14.95 arc(54.32,15.3) 54.13,15.59 26.85,42.87 arc(26.41,43.17) v1(25.88,43.27) ; J1.150 5.67,64.87 arc(5.85,64.91) v1(5.99,65.01)
  Bottom Layer w0.165: 25.87,43.29 24.11,45.05 arc(23.33,45.57) 22.4,45.75 7.19,45.75 arc(6.21,45.94) 5.39,46.49 3.89,47.99 arc(3.34,48.81) 3.15,49.79 3.15,61.88 arc(3.34,62.85) 3.89,63.67 4.64,64.42 arc(4.88,64.62) 5.14,64.78 arc(5.27,64.84) 5.4,64.89 arc(5.7,64.96) 6,64.98
PCIE_RX_1N: length 104.3
  Top Layer w0.165: J1.142 5.07,62.87 arc(5.13,62.89) 5.18,62.92 arc(5.23,62.95) 5.29,62.97 6.2,62.97 arc(7.03,63.13) 7.72,63.59 arc(8.01,63.65) 8.26,63.82 v1(8.37,63.93) ; U2.SA8 67.27,9.06 arc(67.18,9.04) 67.1,8.99 arc(67.02,8.93) 66.93,8.91 65.73,8.91 arc(64.88,9.08) 64.16,9.56 62.66,11.06 arc(61.87,11.59) 60.94,11.78 59.16,11.78 arc(58.64,11.97) 58.19,12.3 55.57,14.92 arc(55.56,14.93) 55.56,14.95 arc(55.4,15.75) 54.95,16.42 47.04,24.33 arc(47,24.44) 47.04,24.55 arc(47.09,24.65) 47.04,24.76 46.9,24.9 arc(46.79,24.95) 46.68,24.9 arc(46.58,24.86) 46.47,24.9 46.33,25.05 arc(46.28,25.16) 46.33,25.26 arc(46.37,25.37) 46.33,25.48 46.18,25.62 arc(46.07,25.67) 45.97,25.62 arc(45.86,25.58) 45.75,25.62 35.46,35.91 arc(34.95,36.68) 34.77,37.58 34.77,49.52 arc(34.84,49.85) 35.03,50.13 v1(35.03,50.14)
  Bottom Layer w0.165: v1(35.03,50.14) 34.67,50.51 arc(34.56,50.67) 34.52,50.86 arc(34.48,51.05) 34.38,51.21 27.57,58.02 arc(26.74,58.57) 25.77,58.77 16.51,58.77 arc(16.02,58.87) 15.59,59.15 15.58,59.17 arc(14.75,59.72) 13.78,59.91 8.56,59.91 arc(8.5,59.9) 8.43,59.9 8.15,59.9 arc(8.09,59.9) 8.02,59.91 5.77,59.91 arc(5.11,60.04) 4.55,60.42 arc(4.45,60.56) 4.42,60.73 4.42,61.43 arc(4.54,62.02) 4.87,62.52 5.31,62.96 arc(5.45,63.05) 5.61,63.09 6.81,63.09 arc(7.18,63.16) 7.5,63.37 7.61,63.48 arc(7.73,63.56) 7.88,63.59 arc(8.02,63.62) 8.15,63.7 v1(8.37,63.93)
PCIE_RX_1P: length 104.3
  Top Layer w0.165: U2.SB8 67.27,8.46 arc(67.18,8.47) 67.1,8.53 arc(67.02,8.58) 66.93,8.6 65.73,8.6 arc(64.76,8.79) 63.94,9.34 62.44,10.84 arc(61.75,11.3) 60.94,11.46 59.13,11.46 arc(58.5,11.68) 57.97,12.07 55.33,14.71 arc(55.27,14.82) 55.24,14.95 arc(55.11,15.63) 54.73,16.2 35.24,35.69 arc(34.66,36.56) 34.45,37.58 34.45,48.44 arc(34.26,49.42) 33.71,50.24 v1(33.69,50.26) ; v1(7.83,64.46) 7.72,64.35 arc(7.55,64.11) 7.5,63.82 arc(6.9,63.42) 6.2,63.28 5.29,63.28 arc(5.23,63.3) 5.18,63.33 arc(5.13,63.36) 5.07,63.37 J1.144
  Bottom Layer w0.165: v1(7.83,64.46) 7.61,64.24 arc(7.52,64.12) 7.5,63.98 arc(7.47,63.83) 7.38,63.71 7.27,63.6 arc(7.06,63.45) 6.81,63.4 5.61,63.4 arc(5.33,63.35) 5.08,63.18 4.64,62.74 arc(4.24,62.14) 4.1,61.43 4.1,60.73 arc(4.16,60.44) 4.32,60.19 arc(4.99,59.75) 5.77,59.59 7.88,59.58 arc(8.15,59.53) 8.43,59.58 arc(8.51,59.58) 8.59,59.59 13.78,59.59 arc(14.63,59.42) 15.35,58.94 15.37,58.92 arc(15.9,58.57) 16.51,58.45 25.77,58.45 arc(26.62,58.28) 27.34,57.8 34.15,50.99 arc(34.19,50.93) 34.2,50.86 34.2,50.85 arc(34.19,50.78) 34.15,50.71 v1(33.69,50.26)
PCIE_RX_2N: length 101
  Top Layer w0.165: J1.136 7.58,61.37 arc(8,61.29) v1(8.36,61.05) ; U2.SD6 70.57,7.26 arc(70.48,7.24) 70.4,7.19 70.39,7.17 arc(70.32,7.13) 70.24,7.11 70.23,7.11 arc(70.17,7.13) 70.12,7.16 70.1,7.17 arc(70.06,7.24) 70.05,7.31 70.05,9.49 arc(69.85,10.46) 69.3,11.28 65.87,14.72 arc(65.04,15.27) 64.07,15.46 63.38,15.46 arc(62.53,15.63) 61.81,16.11 44.74,33.18 arc(44.66,33.36) 44.74,33.54 44.87,33.67 arc(44.87,34.02) 44.51,34.02 44.38,33.9 arc(44.2,33.82) 44.02,33.9 37.93,39.99 arc(37.38,40.81) 37.18,41.79 37.18,44.75 arc(37.22,44.91) 37.31,45.05 38.33,46.07 arc(39.12,46.6) v1(40.06,46.79)
  Bottom Layer w0.165: v1(40.06,46.79) 39.62,47.23 arc(39.47,47.34) 39.36,47.49 38.19,48.66 arc(38.01,48.93) 37.95,49.24 37.95,49.4 arc(37.75,50.37) 37.2,51.19 27.55,60.85 arc(26.83,61.33) 25.98,61.5 9.43,61.5 arc(8.85,61.38) v1(8.36,61.05)
PCIE_RX_2P: length 101
  Top Layer w0.165: J1.138 6.36,61.87 arc(6.62,61.93) v1(6.83,62.07) ; U2.SE6 70.57,6.66 arc(70.48,6.67) 70.4,6.73 arc(70.32,6.78) 70.23,6.8 arc(70.05,6.83) 69.89,6.94 69.88,6.95 arc(69.77,7.12) 69.73,7.31 69.73,9.49 arc(69.56,10.34) 69.08,11.06 65.64,14.49 arc(64.92,14.97) 64.07,15.14 63.38,15.14 arc(62.41,15.34) 61.58,15.89 37.23,40.24 arc(36.68,41.06) 36.49,42.04 36.49,44.19 arc(36.68,45.16) 37.23,45.99 38.33,47.09 arc(39.03,47.56) v1(39.85,47.72)
  Bottom Layer w0.165: v1(39.85,47.72) 39.85,47.94 arc(39.66,48.91) 39.11,49.74 27.77,61.07 arc(26.95,61.62) 25.98,61.82 7.44,61.82 arc(7.11,61.88) v1(6.83,62.07)
PCIE_RX_3N: length 90.1
  Top Layer w0.165: U2.SA6 70.98,10.7 arc(70.87,11.28) 70.54,11.76 70.46,11.85 arc(70.42,11.87) 70.39,11.88 arc(70.35,11.89) 70.32,11.91 65.69,16.54 arc(65.2,16.87) 64.62,16.98 64.14,16.98 arc(63.29,17.15) 62.57,17.64 60.48,19.73 arc(60.35,19.92) 60.3,20.16 arc(60.15,20.9) 59.74,21.52 40.26,41 arc(40.23,41.04) 40.22,41.08 arc(40.21,41.12) 40.19,41.16 39.99,41.35 arc(39.79,41.65) 39.72,42 arc(39.65,42.36) 39.45,42.65 39.13,42.98 arc(38.73,43.24) v1(38.26,43.34) ; J1.120 5.63,57.37 arc(5.8,57.34) v1(5.94,57.24)
  Bottom Layer w0.165: v1(5.94,57.24) 8.35,57.24 arc(9.18,57.08) 9.88,56.61 10.85,55.64 arc(10.89,55.61) 10.93,55.6 arc(10.97,55.59) 11.01,55.57 12.28,54.3 arc(13.1,53.75) 14.07,53.56 27.12,53.56 arc(27.62,53.46) 28.04,53.18 31.04,50.18 arc(31.08,50.09) 31.04,50.01 arc(31.01,49.92) 31.04,49.83 31.23,49.65 arc(31.31,49.61) 31.4,49.65 arc(31.49,49.68) 31.57,49.65 31.76,49.46 arc(31.8,49.37) 31.76,49.29 arc(31.72,49.2) 31.76,49.11 31.95,48.93 arc(32.03,48.89) 32.12,48.93 arc(32.21,48.96) 32.29,48.93 32.48,48.74 arc(32.51,48.65) 32.48,48.57 arc(32.44,48.48) 32.48,48.4 32.66,48.21 arc(32.75,48.17) 32.84,48.21 arc(32.92,48.24) 33.01,48.21 33.2,48.02 arc(33.23,47.94) 33.2,47.85 arc(33.16,47.76) 33.2,47.68 33.38,47.49 arc(33.47,47.45) 33.56,47.49 arc(33.64,47.53) 33.73,47.49 33.92,47.3 arc(33.95,47.22) 33.92,47.13 arc(33.88,47.04) 33.92,46.96 34.1,46.77 arc(34.19,46.74) 34.27,46.77 arc(34.36,46.81) 34.45,46.77 37.61,43.61 arc(37.91,43.41) v1(38.26,43.34)
PCIE_RX_3P: length 90.1
  Top Layer w0.165: J1.122 7.02,57.87 arc(7.19,57.91) v1(7.34,58.01) ; U2.SB6 70.88,8.56 arc(70.81,8.6) 70.73,8.62 70.63,8.62 arc(70.47,8.69) 70.4,8.86 70.4,11.07 arc(70.36,11.28) 70.24,11.46 70.15,11.55 arc(70.13,11.58) 70.12,11.62 arc(70.12,11.65) 70.09,11.68 65.46,16.32 arc(65.07,16.58) 64.62,16.67 64.14,16.67 arc(63.17,16.86) 62.34,17.41 60.25,19.5 arc(60.05,19.8) 59.98,20.16 arc(59.86,20.77) 59.51,21.29 40.03,40.77 arc(39.99,40.8) 39.95,40.81 arc(39.91,40.82) 39.87,40.84 39.41,41.3 arc(39.08,41.8) v1(38.96,42.38)
  Bottom Layer w0.165: v1(38.96,42.38) 38.96,43.22 arc(38.93,43.36) 38.94,43.5 arc(38.85,43.72) 38.71,43.91 38.6,44.02 arc(38.3,44.22) 37.95,44.29 arc(37.42,44.39) 36.98,44.69 28.27,53.4 arc(27.74,53.75) 27.12,53.88 14.07,53.88 arc(13.22,54.05) 12.5,54.53 11.24,55.79 arc(11.21,55.83) 11.2,55.87 arc(11.19,55.92) 11.17,55.95 9.86,57.26 arc(9.04,57.81) 8.07,58.01 v1(7.34,58.01)
PCIE_RX_4N: length 98.1
  Top Layer w0.165: U2.SB3 75.31,8.46 arc(75.5,8.49) 75.67,8.6 arc(75.76,8.74) 75.79,8.91 75.79,9.2 arc(75.6,10.17) 75.05,11 74.16,11.88 arc(74.15,11.89) 74.14,11.89 arc(74.12,11.9) 74.11,11.9 70.73,15.29 arc(70.25,16.01) 70.08,16.86 70.08,21.01 arc(69.88,21.98) 69.33,22.81 50.39,41.75 arc(50.33,42.04) 50.17,42.29 50.17,42.16 v1(50.19,42.14) ; J1.114 5.68,55.87 arc(5.84,55.84) v1(5.97,55.75)
  Bottom Layer w0.165: v1(50.19,42.14) 48.76,40.72 arc(47.94,40.16) 46.96,39.97 40.36,39.97 arc(39.53,40.14) 38.82,40.6 arc(38.81,40.61) 38.81,40.61 27.74,51.69 arc(26.93,52.23) 25.97,52.42 12.19,52.42 arc(12.13,52.43) 12.08,52.47 arc(12.03,52.5) 11.97,52.51 arc(11.36,52.63) 10.84,52.98 8.2,55.62 arc(7.82,55.87) 7.38,55.96 6.48,55.96 arc(6.21,55.91) v1(5.97,55.75)
PCIE_RX_4P: length 98.1
  Top Layer w0.165: v1(48.51,42.87) 49.63,41.75 arc(49.88,41.58) 50.17,41.53 51.02,40.67 arc(51.1,40.49) 51.02,40.31 50.99,40.28 arc(50.99,39.92) 51.35,39.92 51.38,39.95 arc(51.56,40.03) 51.74,39.95 69.11,22.58 arc(69.59,21.86) 69.76,21.01 69.76,16.86 arc(69.95,15.89) 70.5,15.06 73.89,11.68 arc(73.9,11.67) 73.9,11.66 arc(73.9,11.64) 73.91,11.63 74.4,11.14 arc(74.95,10.31) 75.14,9.34 U2.SA3 ; J1.116 6.65,56.37 arc(7.02,56.41) v1(7.37,56.51)
  Bottom Layer w0.165: v1(48.51,42.87) 48.51,42.69 arc(48.31,41.72) 47.76,40.9 47.6,40.73 arc(47.18,40.45) 46.68,40.35 40.65,40.35 arc(39.68,40.55) 38.85,41.1 27.77,52.18 arc(26.94,52.73) 25.97,52.93 12.19,52.93 arc(12.13,52.91) 12.08,52.88 arc(12.03,52.84) 11.97,52.83 arc(11.48,52.93) 11.07,53.2 8.08,56.19 arc(7.97,56.26) 7.83,56.29 7.76,56.29 arc(7.69,56.3) 7.63,56.34 7.58,56.4 arc(7.45,56.48) 7.29,56.51 v1(7.37,56.51)
PCIE_RX_5N: length 96.5
  Top Layer w0.165: v1(72.77,15.62) 73.53,14.87 arc(73.56,14.82) 73.57,14.76 75.81,12.52 arc(76.36,11.7) 76.55,10.73 76.55,7.69 arc(76.47,7.29) 76.25,6.95 76.24,6.94 arc(76.08,6.83) 75.9,6.8 arc(75.81,6.78) 75.73,6.73 arc(75.65,6.67) 75.56,6.66 U2.SE3 ; J1.108 5.87,54.37 arc(6.46,54.49) v1(6.96,54.83)
  Bottom Layer w0.165: v1(72.77,15.62) 71.48,15.62 arc(70.86,15.74) 70.33,16.1 69.62,16.81 arc(69.49,17) 69.44,17.24 arc(69.37,17.59) 69.17,17.89 48.91,38.15 arc(48.09,38.7) 47.12,38.89 40.4,38.89 arc(39.32,39.1) 38.41,39.7 27.05,51.05 arc(26.59,51.36) 26.05,51.47 11.31,51.47 arc(10.52,51.58) 9.78,51.91 9.75,51.91 9.69,51.97 arc(9.49,52.13) 9.29,52.3 7.1,54.49 arc(7,54.65) v1(6.96,54.83)
PCIE_RX_5P: length 96.5
  Top Layer w0.165: U2.SD3 75.56,7.26 arc(75.65,7.24) 75.73,7.19 75.74,7.17 arc(75.81,7.13) 75.88,7.11 75.9,7.11 arc(75.96,7.13) 76.01,7.16 arc(76.18,7.41) 76.24,7.71 76.24,10.73 arc(76.07,11.58) 75.59,12.3 74.29,13.6 arc(74.15,13.65) 74.02,13.6 arc(73.89,13.54) 73.75,13.6 73.66,13.69 arc(73.61,13.82) 73.66,13.96 arc(73.72,14.09) 73.66,14.22 73.08,14.8 arc(72.79,14.86) 72.55,15.02 v1(70.97,16.6) ; J1.110 5.96,54.87 arc(6.22,54.93) 6.43,55.07 6.77,55.41 arc(6.97,55.55) 7.21,55.59 arc(7.33,55.57) 7.43,55.5 v1(7.59,55.34)
  Bottom Layer w0.165: v1(70.97,16.6) 49.1,38.47 arc(48.28,39.02) 47.31,39.21 40.4,39.21 arc(39.42,39.4) 38.6,39.95 27.28,51.27 arc(26.72,51.65) 26.05,51.78 11.31,51.78 arc(10.34,51.98) 9.52,52.53 8.22,53.82 arc(7.76,54.52) v1(7.59,55.34)
PCIE_RX_6N: length 95.3
  Top Layer w0.165: U2.SB1 79.58,8.46 arc(79.65,8.43) v1(79.69,8.36) ; J1.102 5.19,52.87 arc(5.53,52.85) 5.87,52.78 arc(6.22,52.66) 6.55,52.48 arc(6.59,52.45) 6.64,52.42 arc(6.82,52.28) 6.98,52.13 v1(7.01,52.11)
  Bottom Layer w0.165: v1(79.69,8.36) 79.5,8.36 arc(79.36,8.39) 79.23,8.47 79.23,8.47 arc(79.11,8.55) 78.98,8.58 arc(78.84,8.61) 78.72,8.68 73.93,13.48 arc(73.21,13.96) 72.36,14.13 71.76,14.13 arc(70.79,14.32) 69.96,14.87 66.44,18.4 arc(66.17,18.8) 66.08,19.27 48.5,36.84 arc(47.78,37.33) 46.93,37.5 41.42,37.5 arc(41.36,37.47) 41.33,37.41 arc(41.31,37.34) 41.25,37.32 40.92,37.32 arc(40.85,37.34) 40.83,37.41 arc(40.8,37.47) 40.74,37.5 40.41,37.5 arc(40.34,37.47) 40.32,37.41 arc(40.29,37.34) 40.23,37.32 39.9,37.32 arc(39.84,37.34) 39.81,37.41 arc(39.78,37.47) 39.72,37.5 39.29,37.5 arc(38.87,37.58) 38.51,37.82 26.66,49.67 arc(25.93,50.15) 25.08,50.32 10.55,50.32 arc(10.01,50.38) 9.49,50.55 arc(9.1,50.78) 8.75,51.07 8.19,51.63 arc(7.71,51.96) 7.16,52.1 arc(7.09,52.11) 7.03,52.11 v1(7.01,52.11)
PCIE_RX_6P: length 95.2
  Top Layer w0.165: J1.104 5.74,53.37 arc(6.36,53.25) v1(6.89,52.89) ; v1(79.82,9.12) 79.76,9.06 U2.SA1
  Bottom Layer w0.165: v1(79.82,9.12) 79.51,9.12 arc(79.36,9.09) 79.24,9.01 79.19,8.96 arc(79.12,8.91) 79.04,8.9 78.98,8.9 arc(78.96,8.9) 78.95,8.91 74.15,13.7 arc(73.33,14.25) 72.36,14.44 71.76,14.44 arc(70.91,14.61) 70.19,15.1 66.66,18.62 arc(66.46,18.92) 66.39,19.27 arc(66.37,19.39) 66.3,19.5 48.73,37.07 arc(47.9,37.62) 46.93,37.81 40.01,37.81 arc(39.04,38.01) 38.22,38.56 26.88,49.9 arc(26.06,50.45) 25.08,50.64 10.55,50.64 arc(9.7,50.81) 8.97,51.29 7.71,52.56 arc(7.33,52.81) v1(6.89,52.89)
PCIE_RX_7N: length 100.8
  Top Layer w0.165: J1.96 4.96,51.37 arc(5.42,51.28) 5.82,51.02 6.38,50.45 arc(6.88,50.12) v1(7.47,50) ; U2.SD1 79.62,7.26 arc(79.67,7.28) v1(79.69,7.34)
  Bottom Layer w0.165: v1(7.47,50) 7.48,50.02 8.34,50.02 arc(9.06,49.54) 9.91,49.37 10.28,49.37 arc(10.37,49.4) 10.41,49.49 arc(10.44,49.58) 10.53,49.61 10.79,49.61 arc(10.88,49.58) 10.91,49.49 arc(10.95,49.4) 11.03,49.37 11.3,49.37 arc(11.39,49.4) 11.42,49.49 arc(11.46,49.58) 11.54,49.61 11.81,49.61 arc(11.89,49.58) 11.93,49.49 arc(11.96,49.4) 12.05,49.37 12.32,49.37 arc(12.4,49.4) 12.44,49.49 arc(12.47,49.58) 12.56,49.61 12.83,49.61 arc(12.91,49.58) 12.95,49.49 arc(12.98,49.4) 13.07,49.37 13.33,49.37 arc(13.42,49.4) 13.45,49.49 arc(13.49,49.58) 13.57,49.61 13.84,49.61 arc(13.93,49.58) 13.96,49.49 arc(14,49.4) 14.08,49.37 14.35,49.37 arc(14.43,49.4) 14.47,49.49 arc(14.5,49.58) 14.59,49.61 14.86,49.61 arc(14.94,49.58) 14.98,49.49 arc(15.01,49.4) 15.1,49.37 15.36,49.37 arc(15.45,49.4) 15.49,49.49 arc(15.52,49.58) 15.61,49.61 15.87,49.61 arc(15.96,49.58) 15.99,49.49 arc(16.03,49.4) 16.11,49.37 16.38,49.37 arc(16.47,49.4) 16.5,49.49 arc(16.54,49.58) 16.62,49.61 16.89,49.61 arc(16.97,49.58) 17.01,49.49 arc(17.04,49.4) 17.13,49.37 17.4,49.37 arc(17.48,49.4) 17.52,49.49 arc(17.55,49.58) 17.64,49.61 17.91,49.61 arc(17.99,49.58) 18.03,49.49 arc(18.06,49.4) 18.15,49.37 18.41,49.37 arc(18.5,49.4) 18.53,49.49 arc(18.57,49.58) 18.65,49.61 18.92,49.61 arc(19.01,49.58) 19.04,49.49 arc(19.08,49.4) 19.16,49.37 19.43,49.37 arc(19.51,49.4) 19.55,49.49 arc(19.58,49.58) 19.67,49.61 19.94,49.61 arc(20.02,49.58) 20.06,49.49 arc(20.09,49.4) 20.18,49.37 20.44,49.37 arc(20.53,49.4) 20.57,49.49 arc(20.6,49.58) 20.69,49.61 20.95,49.61 arc(21.04,49.58) 21.07,49.49 arc(21.11,49.4) 21.19,49.37 21.46,49.37 arc(21.55,49.4) 21.58,49.49 arc(21.62,49.58) 21.7,49.61 21.97,49.61 arc(22.05,49.58) 22.09,49.49 arc(22.12,49.4) 22.21,49.37 22.48,49.37 arc(22.56,49.4) 22.6,49.49 arc(22.63,49.58) 22.72,49.61 22.98,49.61 arc(23.07,49.58) 23.11,49.49 arc(23.14,49.4) 23.23,49.37 24.32,49.37 arc(25.29,49.18) 26.12,48.63 26.43,48.31 arc(26.56,48.26) 26.69,48.31 arc(26.82,48.36) 26.94,48.31 27.05,48.21 arc(27.1,48.08) 27.05,47.95 arc(26.99,47.82) 27.05,47.7 27.15,47.59 arc(27.28,47.54) 27.41,47.59 arc(27.53,47.65) 27.66,47.59 27.77,47.49 arc(27.82,47.36) 27.77,47.23 arc(27.71,47.11) 27.77,46.98 27.87,46.87 arc(28,46.82) 28.12,46.87 arc(28.25,46.93) 28.38,46.87 28.48,46.77 arc(28.54,46.64) 28.48,46.52 arc(28.43,46.39) 28.48,46.26 28.59,46.16 arc(28.72,46.1) 28.84,46.16 arc(28.97,46.21) 29.1,46.16 29.2,46.05 arc(29.25,45.92) 29.2,45.8 arc(29.15,45.67) 29.2,45.54 29.31,45.44 arc(29.43,45.38) 29.56,45.44 arc(29.69,45.49) 29.82,45.44 29.92,45.33 arc(29.97,45.21) 29.92,45.08 arc(29.87,44.95) 29.92,44.82 30.02,44.72 arc(30.15,44.67) 30.28,44.72 arc(30.41,44.77) 30.54,44.72 30.64,44.62 arc(30.69,44.49) 30.64,44.36 arc(30.59,44.23) 30.64,44.1 37.57,37.17 arc(38.27,36.71) 39.09,36.54 46.17,36.54 arc(47.14,36.35) 47.96,35.8 70.06,13.7 arc(70.78,13.22) 71.63,13.05 72.11,13.05 arc(72.84,12.9) 73.46,12.49 78.82,7.13 arc(78.83,7.12) 78.85,7.11 78.91,7.11 arc(78.99,7.13) 79.05,7.17 79.21,7.33 arc(79.23,7.33) 79.24,7.34 v1(79.69,7.34)
PCIE_RX_7P: length 100.9
  Top Layer w0.165: U2.SE1 79.62,6.66 arc(79.67,6.63) v1(79.69,6.57) ; J1.98 5.16,51.87 arc(5.45,51.82) 5.69,51.66 arc(6.39,51.19) 7.22,51.02 v1(7.47,51.02)
  Bottom Layer w0.165: v1(7.47,51.02) 7.19,51.02 arc(6.86,50.95) 6.58,50.77 arc(6.39,50.49) 6.32,50.15 6.32,50.11 arc(6.39,49.78) 6.58,49.5 arc(7.14,49.12) 7.8,48.99 24.19,48.99 arc(25.17,48.8) 25.99,48.24 37.33,36.91 arc(38.15,36.35) 39.13,36.16 46.32,36.16 arc(47.09,36.01) 47.74,35.57 50.48,32.83 arc(50.56,32.65) 50.48,32.47 50.31,32.29 arc(50.31,31.93) 50.67,31.93 50.84,32.11 arc(51.2,32.11) 51.2,31.75 51.02,31.57 arc(51.02,31.21) 51.38,31.21 51.56,31.39 arc(51.92,31.39) 51.92,31.03 51.74,30.85 arc(51.74,30.49) 52.1,30.49 52.28,30.67 arc(52.46,30.75) 52.64,30.67 69.9,13.41 arc(70.72,12.86) 71.7,12.67 72.24,12.67 arc(72.71,12.57) 73.1,12.31 78.23,7.18 arc(78.9,6.73) v1(79.69,6.57)
PCIE_TX_0N: length 33.6
  Top Layer w0.165: U2.SG8 67.27,5.46 arc(67.18,5.44) 67.1,5.38 arc(67.02,5.33) 66.93,5.31 66.35,5.31 arc(65.5,5.48) 64.78,5.97 64.71,6.03 arc(64.66,6.32) 64.49,6.57 v1(64.51,6.55) ; C2.2 44.68,23.71 arc(44.88,23.41) v1(44.95,23.06)
  Bottom Layer w0.165: v1(64.51,6.55) 63.22,7.84 arc(62.96,7.89) 62.74,8.04 53.84,16.94 arc(53.01,17.49) 52.04,17.68 50.94,17.68 arc(50.09,17.85) 49.36,18.33 45.28,22.42 arc(45.23,22.71) 45.06,22.95 v1(44.95,23.06)
PCIE_TX_0P: length 33.8
  Top Layer w0.165: C1.2 42.47,24.15 arc(42.72,23.98) v1(43.02,23.92) ; U2.SH8 67.27,4.86 arc(67.18,4.87) 67.1,4.93 arc(67.02,4.98) 66.93,5 66.35,5 arc(65.38,5.19) 64.56,5.74 64.49,5.81 arc(64.2,5.87) 63.95,6.03 v1(62.95,7.03)
  Bottom Layer w0.165: v1(43.02,23.92) 44.52,22.41 arc(44.77,22.25) 45.06,22.19 49.14,18.11 arc(49.96,17.56) 50.94,17.37 52.04,17.37 arc(52.89,17.2) 53.61,16.72 62.38,7.94 arc(62.53,7.72) 62.58,7.46 62.91,7.13 arc(62.94,7.09) v1(62.95,7.03)
PCIE_TX_1N: length 31.7
  Top Layer w0.165: U2.SK8 67.58,3.56 arc(67.51,3.51) 67.43,3.49 67.33,3.49 arc(67.17,3.42) 67.1,3.26 v1(67.1,0.98) ; C4.2 46.49,17.71 arc(46.65,17.61) v1(46.83,17.57)
  Bottom Layer w0.165: v1(67.1,0.98) 66.94,1.14 arc(66.81,1.33) 66.77,1.57 arc(66.72,1.8) 66.59,2 55.3,13.29 arc(54.58,13.77) 53.73,13.94 51.83,13.94 arc(50.85,14.13) 50.03,14.68 48.74,15.97 arc(48.45,16.03) 48.2,16.19 v1(46.83,17.57)
PCIE_TX_1P: length 31.7
  Top Layer w0.165: C3.2 48.22,18.01 arc(48.62,17.42) v1(48.76,16.71) ; v1(67.66,1.87) 67.66,3.01 arc(67.67,3.03) U2.SL8
  Bottom Layer w0.165: v1(48.76,16.71) 48.74,16.73 arc(48.91,16.48) 48.97,16.19 50.25,14.91 arc(50.98,14.42) 51.83,14.25 53.73,14.25 arc(54.7,14.06) 55.52,13.51 64.26,4.78 arc(64.44,4.7) 64.62,4.78 64.64,4.8 arc(65,4.8) 65,4.44 64.98,4.42 arc(64.98,4.06) 65.33,4.06 65.36,4.08 arc(65.72,4.08) 65.72,3.72 65.69,3.7 arc(65.69,3.34) 66.05,3.34 66.08,3.36 arc(66.44,3.36) 66.44,3 66.41,2.98 arc(66.34,2.8) 66.41,2.62 66.65,2.38 arc(66.85,2.25) 67.08,2.2 arc(67.31,2.16) 67.51,2.03 v1(67.66,1.87)
PCIE_TX_2N: length 11.1
  Top Layer w0.165: U2.SH6 70.8,4.86 arc(70.42,4.77) v1(70.12,4.52) ; C6.2 63.64,11.11 arc(63.74,11.04) v1(63.85,11.02)
  Bottom Layer w0.165: v1(63.85,11.02) arc(63.95,10.55) 64.21,10.15 69.73,4.63 arc(69.92,4.55) v1(70.12,4.52)
PCIE_TX_2P: length 11.1
  Top Layer w0.165: U2.SG6 70.5,5.46 arc(70.29,5.41) v1(70.1,5.29) ; C5.2 v1(64.87,11.9)
  Bottom Layer w0.165: v1(64.87,11.9) 64.87,11.05 arc(65.06,10.08) 65.61,9.26 66.15,8.72 arc(66.21,8.7) 66.27,8.72 arc(66.34,8.75) 66.4,8.72 66.63,8.49 arc(66.66,8.43) 66.63,8.36 arc(66.61,8.3) 66.63,8.24 68.63,6.24 arc(68.83,6.11) 69.06,6.06 arc(69.31,6.01) 69.52,5.87 69.63,5.77 arc(69.7,5.68) 69.78,5.61 v1(70.1,5.29)
PCIE_TX_3N: length 20.4
  Top Layer w0.165: U2.SK6 70.88,3.56 arc(70.81,3.51) 70.73,3.49 70.63,3.49 arc(70.47,3.42) 70.4,3.26 70.4,2.71 arc(70.45,1.95) v1(70.83,1.3) ; v1(59.28,13.05) C8.2
  Bottom Layer w0.165: v1(70.83,1.3) 59.42,12.72 arc(59.32,12.87) v1(59.28,13.05)
PCIE_TX_3P: length 20.4
  Top Layer w0.165: v1(60.3,13.94) 59.63,14.6 arc(59.56,14.7) C7.2 ; U2.SL6 70.98,2.75 arc(71.07,2.33) v1(71.31,1.96)
  Bottom Layer w0.165: v1(71.31,1.96) 64.02,9.25 arc(63.86,9.32) 63.69,9.25 arc(63.52,9.18) 63.35,9.25 63.33,9.27 arc(63.26,9.44) 63.33,9.61 arc(63.4,9.78) 63.33,9.95 63.31,9.97 arc(63.14,10.04) 62.97,9.97 arc(62.8,9.9) 62.63,9.97 62.61,9.99 arc(62.54,10.16) 62.61,10.33 arc(62.68,10.5) 62.61,10.66 62.59,10.69 arc(62.42,10.76) 62.25,10.69 arc(62.08,10.62) 61.91,10.69 61.89,10.71 arc(61.82,10.88) 61.89,11.05 arc(61.96,11.21) 61.89,11.38 60.98,12.3 arc(60.48,13.05) v1(60.3,13.94)
PCIE_TX_4N: length 31
  Top Layer w0.165: U2.SL3 75.14,2.21 arc(75.18,2.03) 75.28,1.87 75.96,1.19 arc(76.76,0.66) 77.7,0.47 79.47,0.47 arc(80.3,0.64) 81,1.11 arc(81.19,1.39) 81.25,1.72 81.25,6.53 arc(81.45,7.51) 82,8.33 83.56,9.89 arc(84.11,10.71) 84.3,11.69 84.3,17.08 arc(84.11,18.05) 83.56,18.87 81.02,21.41 arc(80.82,21.71) C10.2
PCIE_TX_4P: length 31
  Top Layer w0.165: C9.2 arc(80.2,20.95) 80.6,20.69 81.93,19.36 arc(82,19.18) 81.93,19 81.9,18.97 arc(81.9,18.61) 82.26,18.61 82.29,18.64 arc(82.47,18.71) 82.65,18.64 83.18,18.11 arc(83.73,17.29) 83.92,16.31 83.92,11.81 arc(83.73,10.84) 83.18,10.02 81.62,8.46 arc(81.07,7.63) 80.87,6.66 80.87,1.85 arc(80.81,1.52) 80.62,1.24 arc(80.2,0.95) 79.7,0.86 77.47,0.86 arc(76.98,0.95) 76.55,1.24 arc(76.18,1.8) 76.05,2.46 76.05,3.22 arc(76.01,3.38) 75.92,3.52 75.88,3.56 arc(75.78,3.63) 75.67,3.65 75.16,3.65 arc(75.15,3.65) U2.SK3
